# EasyEDA Pro project CameraTargetV1.eprj, board PCB1
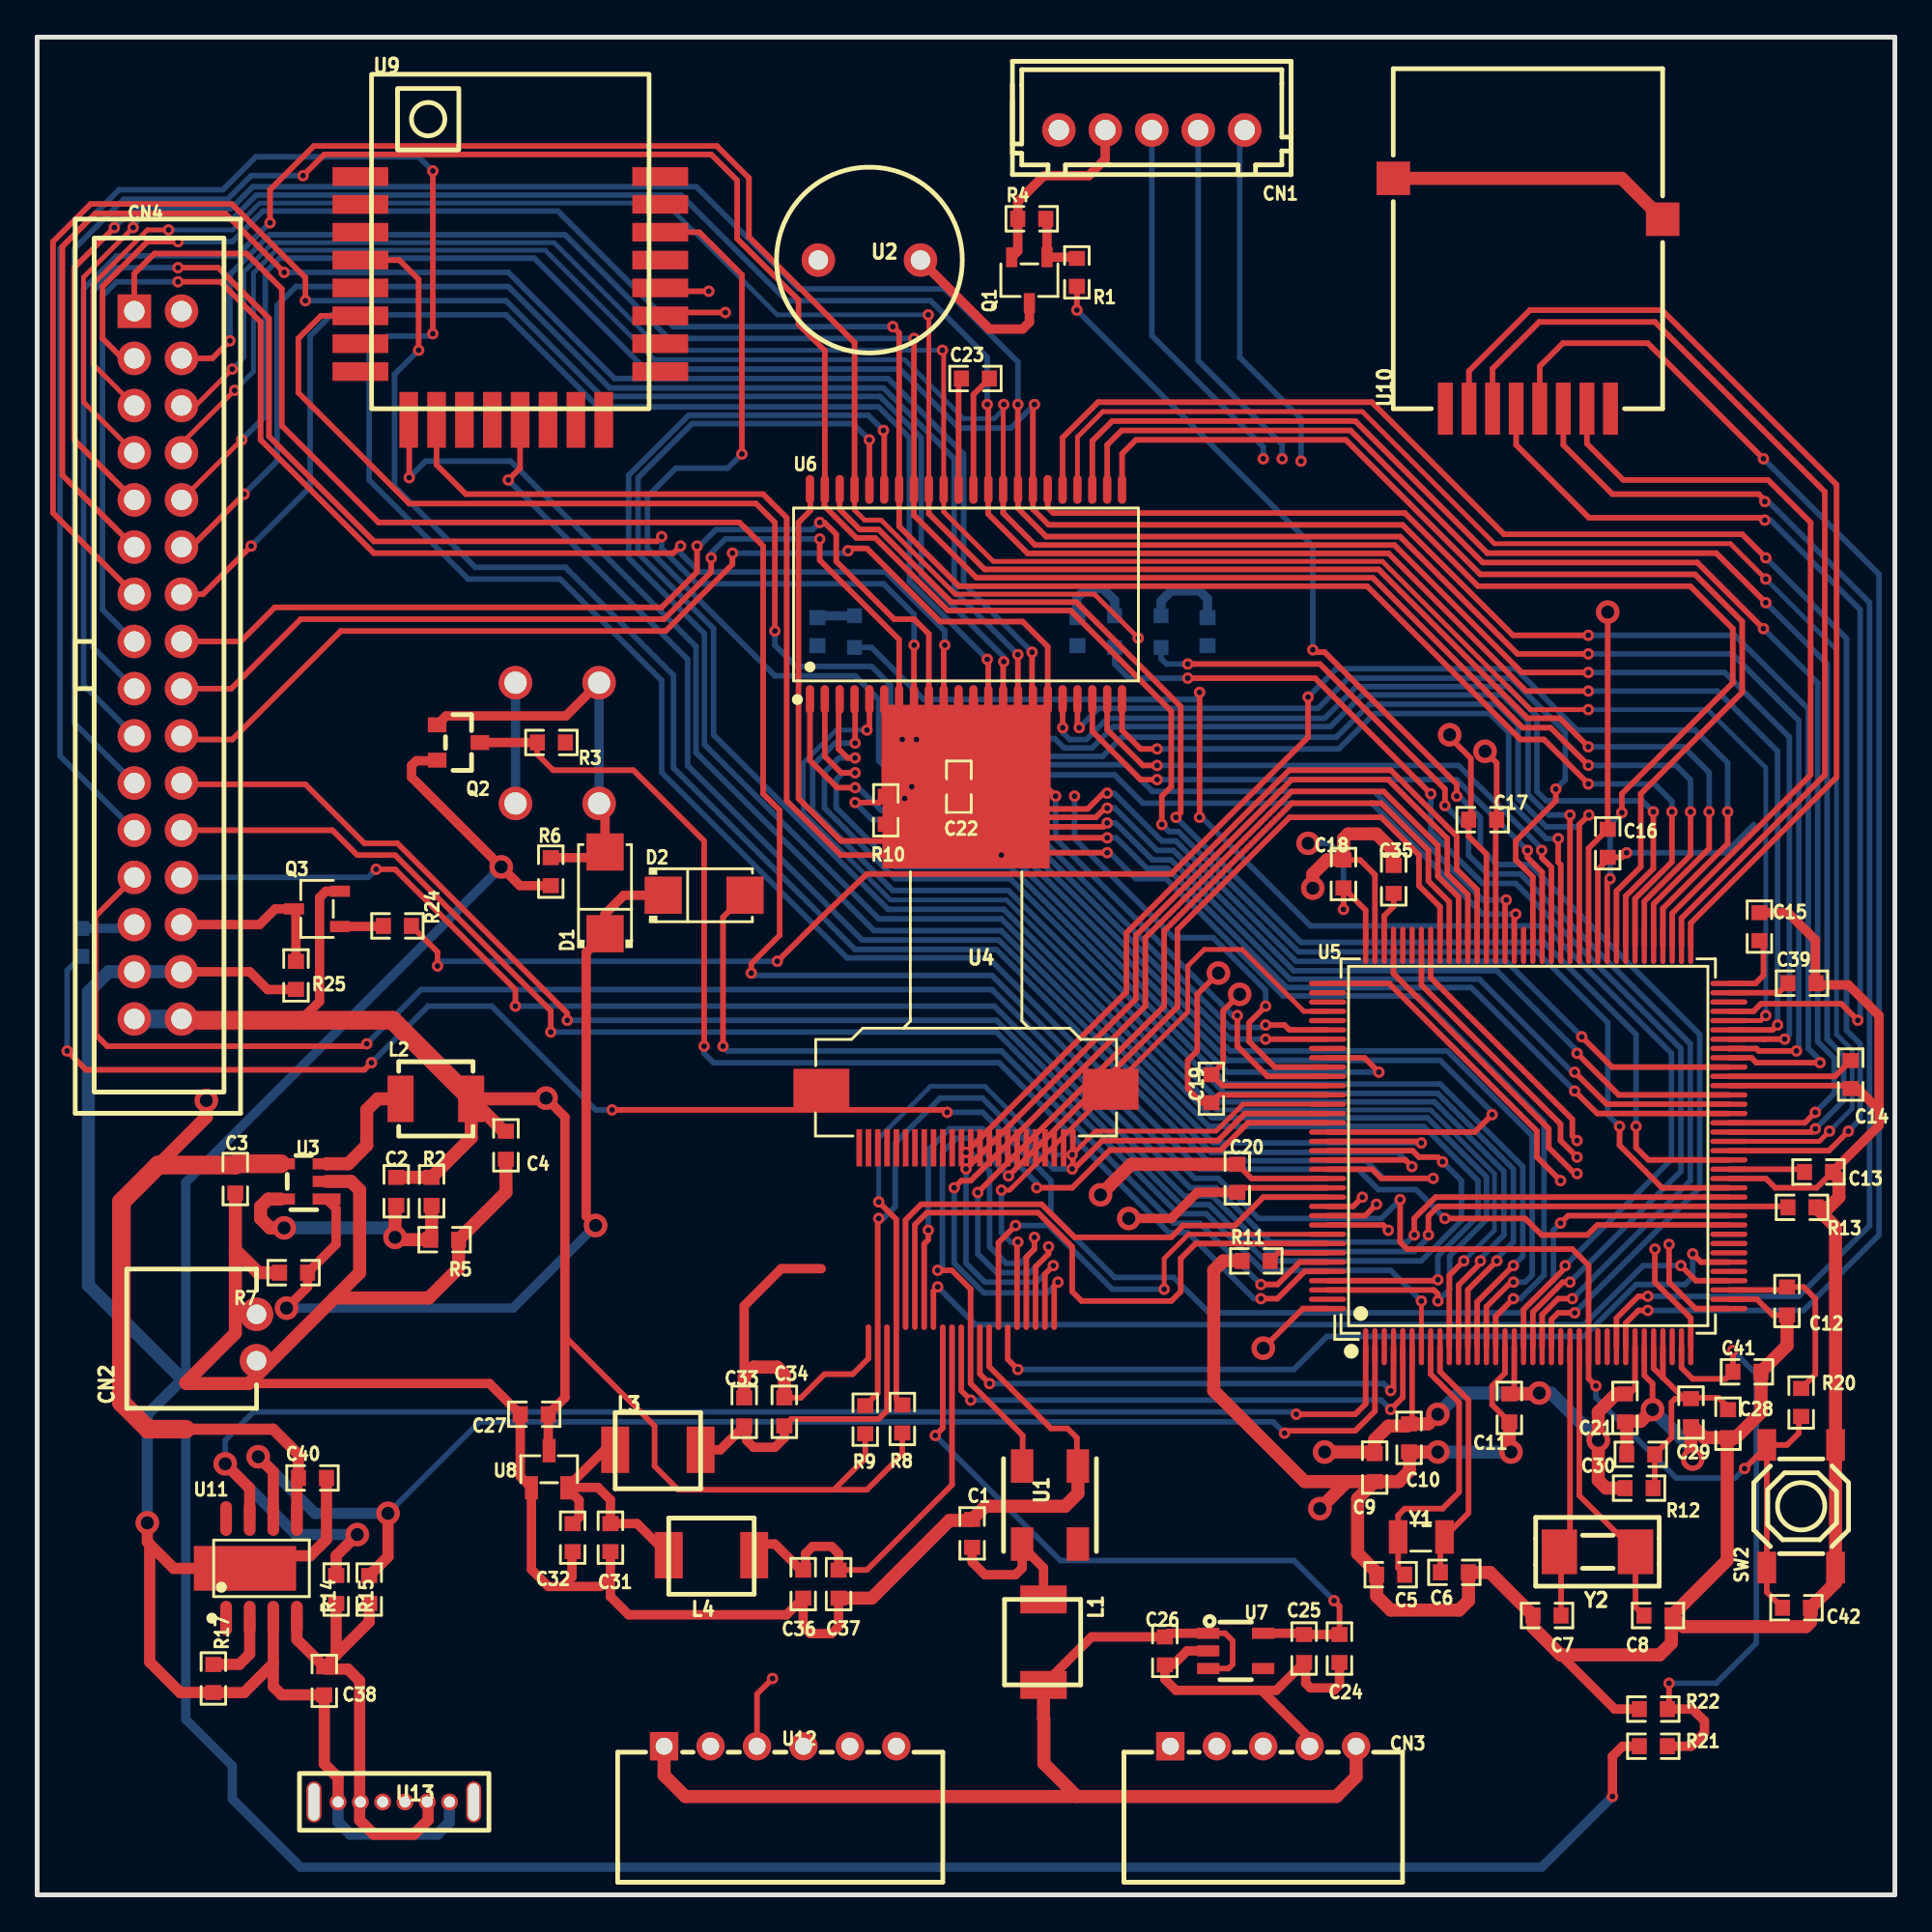
[diagram p1: board, top side]
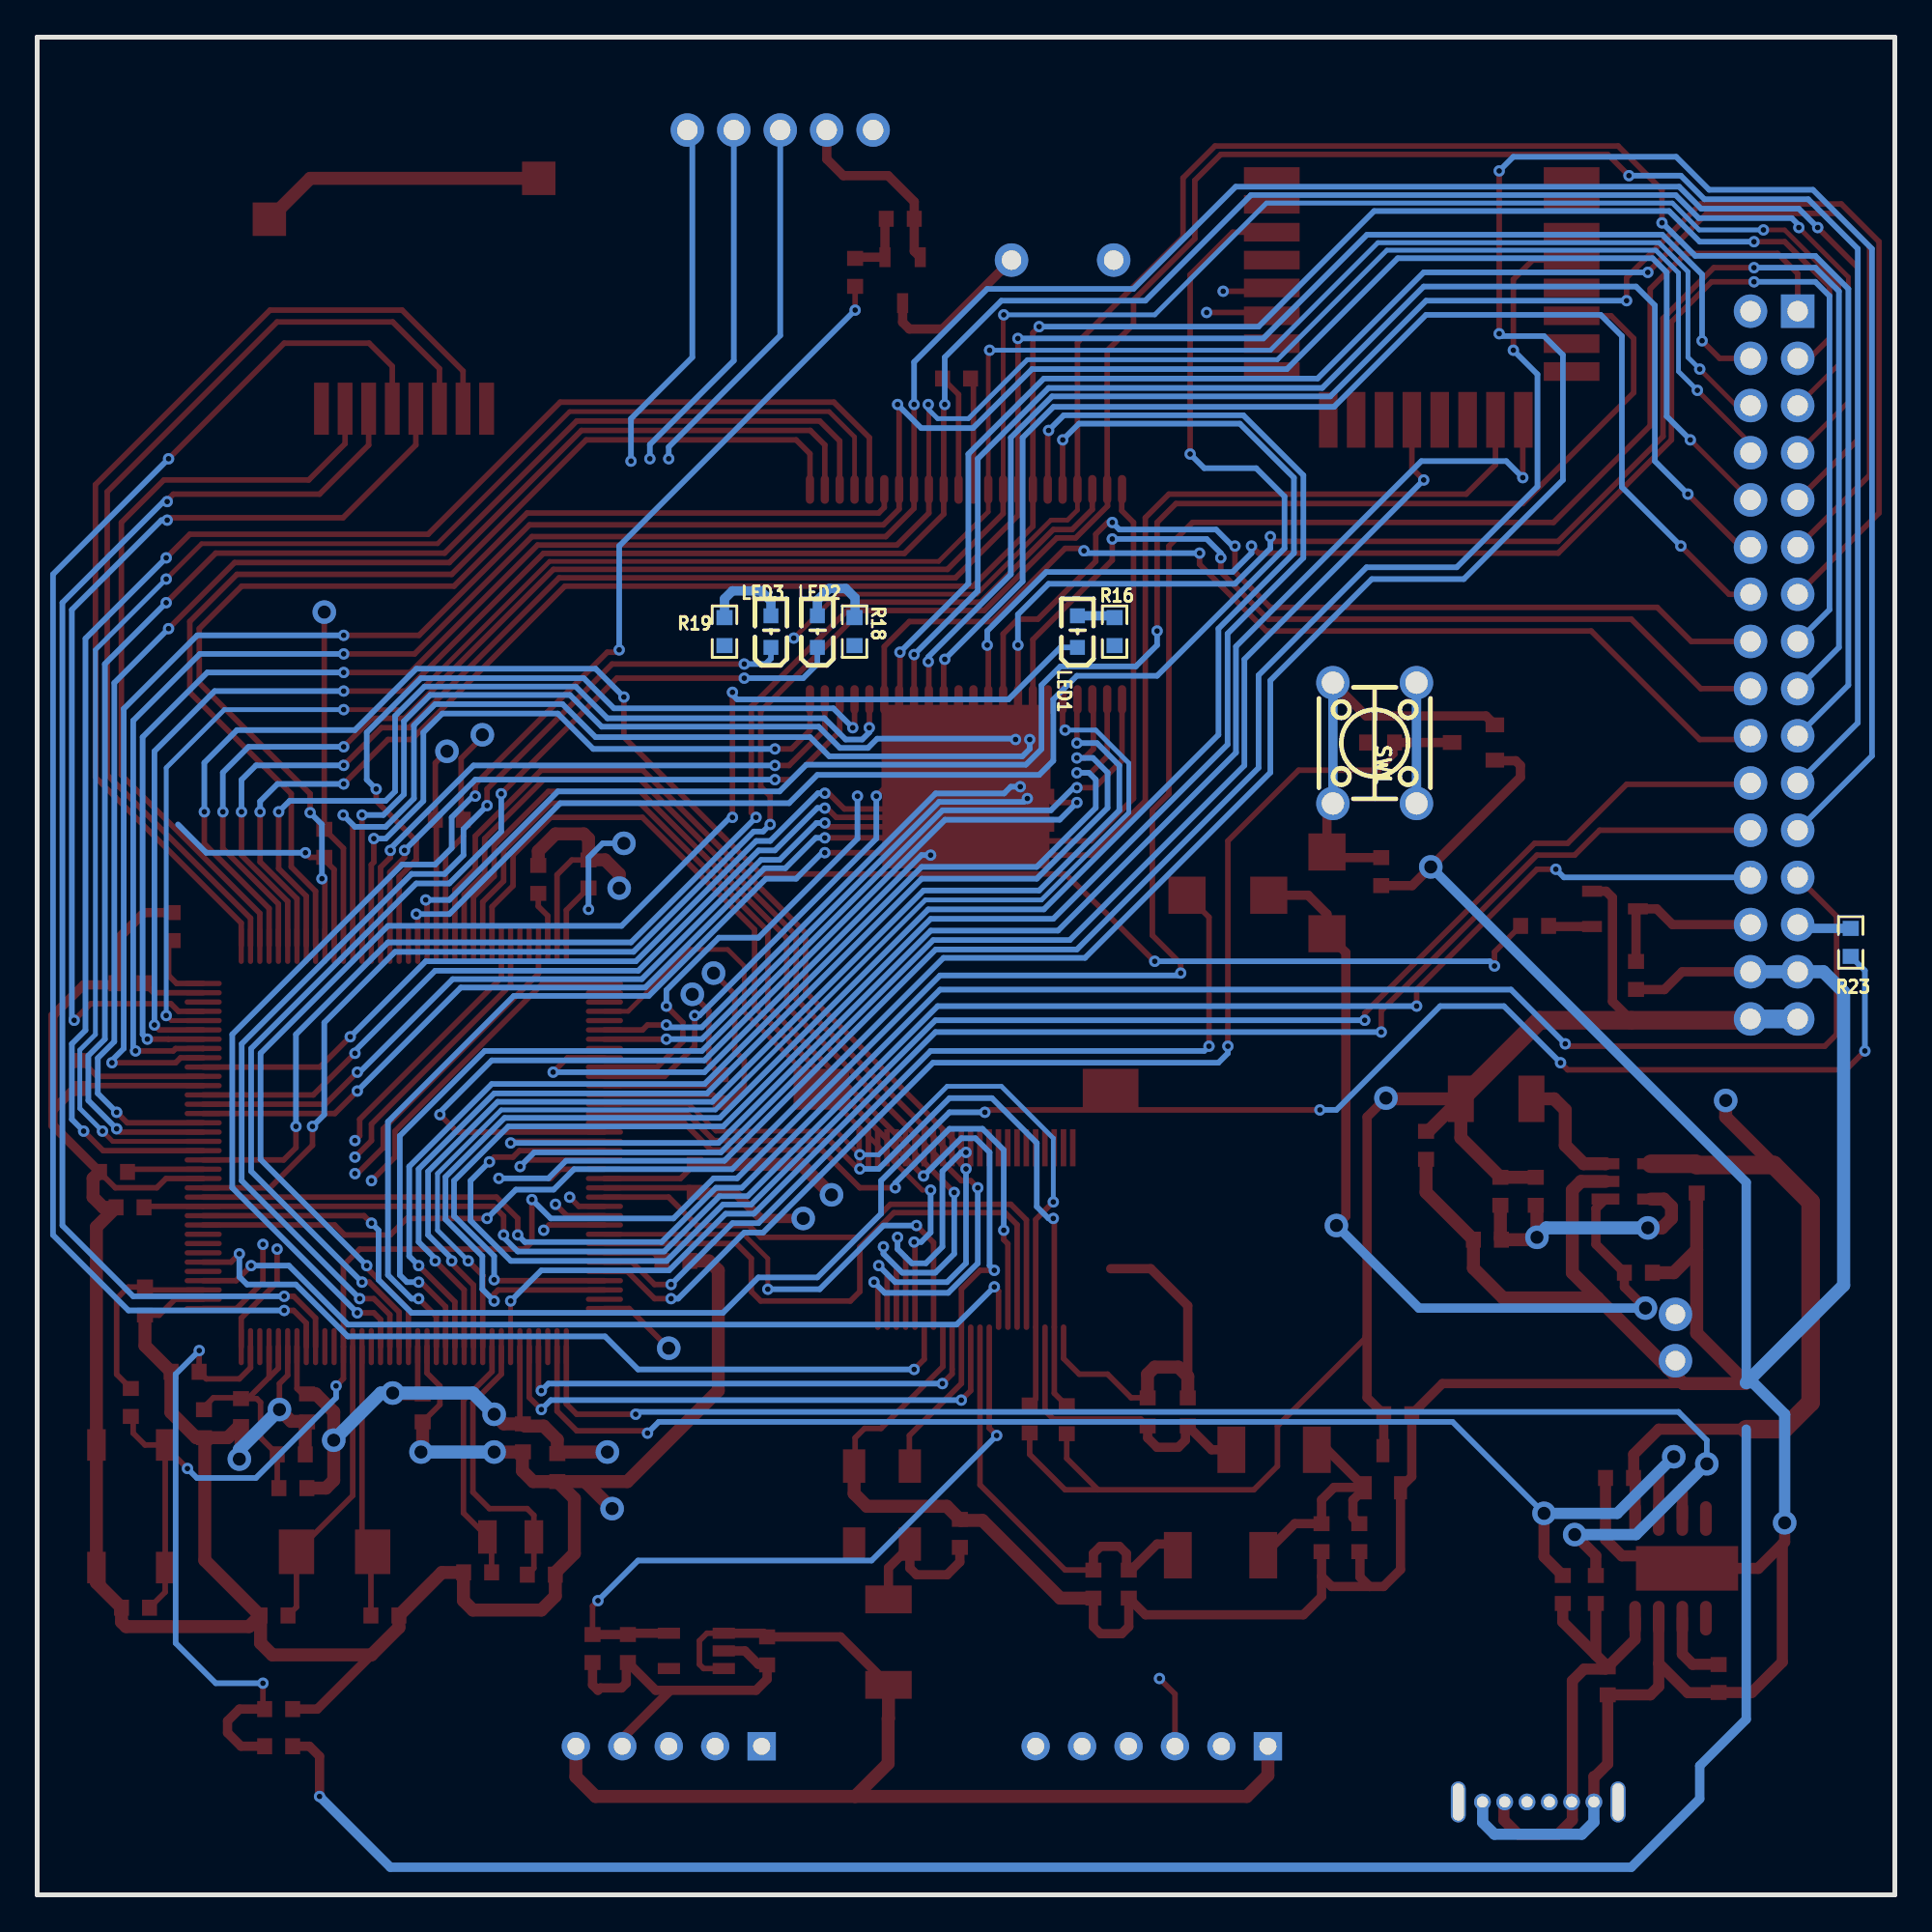
[diagram p2: board, bottom side, seen from below]

Outline 100 x 100 mm; copper layers: Top Layer, CPU1, CPU2, Bottom Layer. Coordinates in mm from the lower left corner of the outline.
Outline path: 0,100 0,0 arc(0,0) 0,0 100,0 arc(100,0) 100,0 100,100 arc(100,100) 100,100 0,100 arc(0,100) 0,100
Stack: Top Layer 0.035mm / Dielectric1 0.48mm PP er 4.5 / CPU1 0.035mm / Dielectric2 0.48mm FR4 er 4.5 / CPU2 0.035mm / Dielectric3 0.48mm PP er 4.5 / Bottom Layer 0.035mm

## Design rules (mm)
spacing safeClearance (default): track to track 0.152, other pairs 0.152 to 0.3
track width trackWidth (default): min 0.127, default 0.254, max 2.54
differential pair differentialPair (default): width min 0.127, default 0.254, max 2.54; gap min 0.152, default 0.152
via viaSize (default): diameter min 0.5, default 0.61, max 10; hole min 0.3, default 0.305, max 6

## Placement (name value [footprint] x y rotation side)
C1  -  [0603]  50.33 19.46 270 top
C2  -  [0603]  19.33 37.87 90 top
C3  -  [0603]  10.67 38.53 90 top
C4  -  [0603]  25.24 40.35 90 top
C5  -  [0603]  72.86 17.23 180 top
C6  -  [0603]  76.29 17.36 0 top
C7  -  [0603]  81.28 15.04 180 top
C8  -  [0603]  87.25 15.04 0 top
C9  -  [0603]  72 23 90 top
C10  -  [0603]  73.85 24.6 90 top
C11  -  [0603]  79.25 26.21 90 top
C12  -  [0603]  94.2 31.97 90 top
C13  -  [0603]  95.89 38.91 180 top
C14  -  [0603]  97.63 44.16 90 top
C15  -  [0603]  92.71 52.12 270 top
C16  -  [0603]  84.54 56.6 90 top
C17  -  [0603]  77.81 57.87 180 top
C18  -  [0603]  70.32 54.95 270 top
C19  -  [0603]  63.21 43.4 270 top
C20  -  [0603]  64.61 38.57 270 top
C21  -  [0603]  85.47 26.21 90 top
C22  -  [0603]  49.62 59.65 90 top
C23  -  [0603]  50.51 81.62 0 top
C24  -  [0603]  70.1 13.26 90 top
C25  -  [0603]  68.2 13.26 90 top
C26  -  [0603]  60.71 13.13 90 top
C27  -  [0603]  26.76 25.87 0 top
C28  -  [0603]  91.02 25.36 90 top
C29  -  [0603]  89.03 25.96 90 top
C30  -  [0603]  86.32 23.71 0 top
C31  -  [0603]  30.86 19.23 90 top
C32  -  [0603]  28.83 19.23 90 top
C33  -  [0603]  38.06 26 270 top
C34  -  [0603]  40.22 26 270 top
C35  -  [0603]  73.03 54.66 90 top
C36  -  [0603]  41.24 16.73 90 top
C37  -  [0603]  43.14 16.73 90 top
C38  -  [0603]  15.46 11.52 90 top
C39  -  [0603]  95 49.07 0 top
C40  -  [0603]  14.82 22.44 180 top
C41  -  [0603]  92.04 28.16 0 top
C42  -  [0603]  94.7 15.46 180 top
CN1  灯板连接口  [CONN-TH_5P-P2.50_HX25003-5A]  60 95 180 top
CN2  -  [XH2.54插件2P]  8 30 270 top
CN3  HDGC2501WR-5P  [CONN-TH_5P-P2.50_HDGC2501WR-5P]  66 8 0 top
CN4  BH-00169  [IDC-TH_BH-00169]  6.5 66.2 270 top
D1  SS14A  [SMA_L4.3-W2.6-LS5.2-RD]  30.57 53.94 90 top
D2  SS14A  [SMA_L4.3-W2.6-LS5.2-RD]  35.9 53.81 0 top
L1  -  [0420]  56.17 15.9 270 top
L2  2.2uH  [IND-SMD_L4.0-W4.0_0.47UH04209.5A]  21.46 42.85 0 top
L3  -  [0420]  31.12 25.96 0 top
L4  -  [0420]  34 20.28 0 top
LED1  RED  [LED0603-R-RD_RED]  44 68 90 bottom
LED2  NCD0603R3  [LED0603-R-RD_RED]  58 68 90 bottom
LED3  NCD0603R3  [LED0603-R-RD_RED]  60.5 68 90 bottom
Q1  S8050  [SOT-23-3_L2.9-W1.6-P1.90-LS2.8-BR]  53.41 86.92 90 top
Q2  AO3400  [SOT-23_L2.9-W1.3-P1.90-LS2.4-BR]  22.68 62.03 180 top
Q3  S9012  [SOT-23-3_L2.9-W1.6-P1.90-LS2.8-BR]  15.07 53.08 0 top
R1  -  [0603]  55.97 87.34 90 top
R2  -  [0603]  21.23 37.87 90 top
R3  -  [0603]  27.68 62.03 180 top
R4  -  [0603]  53.54 90.22 0 top
R5  -  [0603]  21.93 35.27 180 top
R6  -  [0603]  27.65 55.08 270 top
R7  -  [0603]  13.81 33.49 0 top
R8  -  [0603]  46.57 25.62 90 top
R9  -  [0603]  44.58 25.58 90 top
R10  -  [0603]  45.68 58.38 270 top
R11  -  [0603]  65.62 34.13 0 top
R12  -  [0603]  86.23 21.9 180 top
R13  -  [0603]  95 37.01 0 top
R14  -  [0603]  16.1 16.44 270 top
R15  -  [0603]  17.87 16.44 270 top
R16  -  [0603]  42 68 270 bottom
R17  -  [0603]  9.49 11.65 270 top
R18  -  [0603]  56 68 270 bottom
R19  -  [0603]  63 68 270 bottom
R20  -  [0603]  94.96 26.51 270 top
R21  -  [0603]  87 8 0 top
R22  -  [0603]  87 10 180 top
R23  -  [0603]  2.38 51.27 270 bottom
R24  -  [0603]  19.39 52.16 180 top
R25  -  [0603]  13.93 49.49 270 top
SW1  -  [按钮开关]  28 62 90 bottom
SW2  1TS001G-2700-1500-CT  [SW-SMD_4P-L5.1-W5.1-P3.70-LS6.5-TL-2]  94.96 20.92 90 top
U1  -  [5032-4P]  54.52 20.98 90 top
U2  -  [0905蜂鸣器]  44.8 88 0 top
U3  -  [PW2051]  14.35 38.41 0 top
U4  -  [OV2640]  50 50 0 top
U5  STM32F407ZGT6  [LQFP-144_L20.0-W20.0-P0.50-LS22.0-BL]  80.26 40.31 0 top
U6  IS62WV51216BLL-55TLI  [TSOP-44_L18.4-W10.2-P0.80-LS11.8-BL]  50 70 0 top
U7  -  [XC6219B132MR]  64.52 13.13 270 top
U8  XC6206P282MR  [SOT-23-3_L2.9-W1.3-P1.90-LS2.4-BR]  27.56 22.91 270 top
U9  -  [JDY-17]  18 98 0 top
U10  -  [GT-24]  73 80 90 top
U11  -  [PW4056]  12.08 17.58 0 top
U12  HDGC2501WR-6P  [CONN-TH_6P-P2.50_HDGC_HDGC2501WR-6P]  40 8 0 top
U13  -  [typec]  19.2 5 0 top
Y1  -  [3215]  74.51 19.27 180 top
Y2  -  [5032]  83.95 18.47 180 top

## Footprints (pads in the part's own frame, mm; a bottom-side part is the same pattern mirrored in y, then rotated)
0420
  rect 1.5x2.5 smd: 1(0,-2) 2(4.6,-2)
0603
  rect 0.806x0.864 smd: 1(-0.753,0) 2(0.753,0)
0905蜂鸣器
  round 1.8 hole 1.05: 1(-2.75,0) 2(2.75,0)
3215
  rect 1x1.8 smd: 1(-1.25,0) 2(1.25,0)
5032
  rect 1.9x2.401 smd: 1(-2.093,0) 2(2.007,0)
5032-4P
  rect 1.8x1.2 smd: 1(-2.1,-1.5) 2(2.1,-1.5) 3(2.1,1.5) 4(-2.1,1.5)
CONN-TH_5P-P2.50_HDGC2501WR-5P
  rect 1.524x1.524 hole 0.914: 1(-5,0)
  round 1.524 hole 0.914: 2(-2.5,0) 3(0,0) 4(2.5,0) 5(5,0)
CONN-TH_5P-P2.50_HX25003-5A
  round 1.8 hole 1.1: 1(-5,0) 2(-2.5,0) 3(0,0) 4(2.5,0) 5(5,0)
CONN-TH_6P-P2.50_HDGC_HDGC2501WR-6P
  rect 1.524x1.524 hole 0.914: 1(-6.25,0)
  round 1.524 hole 0.914: 2(-3.75,0) 3(-1.25,0) 4(1.25,0) 5(3.75,0) 6(6.25,0)
GT-24
  rect 2.8x0.8 smd: 1(0,-2.805) 2(0,-4.075) 3(0,-5.345) 4(0,-6.615) 5(0,-7.885) 6(0,-9.155) 7(0,-10.425) 8(0,-11.695)
  rect 1.8x1.8 smd: 9(12.4,0) 10(10.2,-14.5)
IDC-TH_BH-00169
  rect 1.8x1.8 hole 1.1: 1(-19.05,-1.27)
  round 1.8 hole 1.1: 2(-19.05,1.27) 3(-16.51,-1.27) 4(-16.51,1.27) 5(-13.97,-1.27) 6(-13.97,1.27) 7(-11.43,-1.27) 8(-11.43,1.27) 9(-8.89,-1.27) 10(-8.89,1.27) 11(-6.35,-1.27) 12(-6.35,1.27) 13(-3.81,-1.27) 14(-3.81,1.27) 15(-1.27,-1.27) 16(-1.27,1.27) 17(1.27,-1.27) 18(1.27,1.27) 19(3.81,-1.27) 20(3.81,1.27) 21(6.35,-1.27) 22(6.35,1.27) 23(8.89,-1.27) 24(8.89,1.27) 25(11.43,-1.27) 26(11.43,1.27) 27(13.97,-1.27) 28(13.97,1.27) 29(16.51,-1.27) 30(16.51,1.27) 31(19.05,-1.27) 32(19.05,1.27)
IND-SMD_L4.0-W4.0_0.47UH04209.5A
  rect 1.399x2.499 smd: 1(-1.9,0) 2(1.9,0)
JDY-17
  rect 3x1 smd: 1(-0.6,-5.5) 2(-0.6,-7) 3(-0.6,-8.5) 4(-0.6,-10) 5(-0.6,-11.5) 6(-0.6,-13) 7(-0.6,-14.5) 8(-0.6,-16) 17(15.54,-16) 18(15.54,-14.5) 19(15.54,-13) 20(15.54,-11.5) 21(15.54,-10) 22(15.54,-8.5) 23(15.54,-7) 24(15.54,-5.5)
  rect 1x3 smd: 9(2,-18.6) 10(3.5,-18.6) 11(5,-18.6) 12(6.5,-18.6) 13(8,-18.6) 14(9.5,-18.6) 15(11,-18.6) 16(12.5,-18.6)
LED0603-R-RD_RED
  rect 0.8x0.8 smd: 1(0.851,0) 2(-0.851,0)
LQFP-144_L20.0-W20.0-P0.50-LS22.0-BL
  oval 0.28x2 smd: 1(-8.75,-10.8) 2(-8.25,-10.8) 3(-7.75,-10.8) 4(-7.25,-10.8) 5(-6.75,-10.8) 6(-6.25,-10.8) 7(-5.75,-10.8) 8(-5.25,-10.8) 9(-4.75,-10.8) 10(-4.25,-10.8) 11(-3.75,-10.8) 12(-3.25,-10.8) 13(-2.75,-10.8) 14(-2.25,-10.8) 15(-1.75,-10.8) 16(-1.25,-10.8) 17(-0.75,-10.8) 18(-0.25,-10.8) 19(0.25,-10.8) 20(0.75,-10.8) 21(1.25,-10.8) 22(1.75,-10.8) 23(2.25,-10.8) 24(2.75,-10.8) 25(3.25,-10.8) 26(3.75,-10.8) 27(4.25,-10.8) 28(4.75,-10.8) 29(5.25,-10.8) 30(5.75,-10.8) 31(6.25,-10.8) 32(6.75,-10.8) 33(7.25,-10.8) 34(7.75,-10.8) 35(8.25,-10.8) 36(8.75,-10.8) 73(8.75,10.8) 74(8.25,10.8) 75(7.75,10.8) 76(7.25,10.8) 77(6.75,10.8) 78(6.25,10.8) 79(5.75,10.8) 80(5.25,10.8) 81(4.75,10.8) 82(4.25,10.8) 83(3.75,10.8) 84(3.25,10.8) 85(2.75,10.8) 86(2.25,10.8) 87(1.75,10.8) 88(1.25,10.8) 89(0.75,10.8) 90(0.25,10.8) 91(-0.25,10.8) 92(-0.75,10.8) 93(-1.25,10.8) 94(-1.75,10.8) 95(-2.25,10.8) 96(-2.75,10.8) 97(-3.25,10.8) 98(-3.75,10.8) 99(-4.25,10.8) 100(-4.75,10.8) 101(-5.25,10.8) 102(-5.75,10.8) 103(-6.25,10.8) 104(-6.75,10.8) 105(-7.25,10.8) 106(-7.75,10.8) 107(-8.25,10.8) 108(-8.75,10.8)
  oval 2x0.28 smd: 37(10.8,-8.75) 38(10.8,-8.25) 39(10.8,-7.75) 40(10.8,-7.25) 41(10.8,-6.75) 42(10.8,-6.25) 43(10.8,-5.75) 44(10.8,-5.25) 45(10.8,-4.75) 46(10.8,-4.25) 47(10.8,-3.75) 48(10.8,-3.25) 49(10.8,-2.75) 50(10.8,-2.25) 51(10.8,-1.75) 52(10.8,-1.25) 53(10.8,-0.75) 54(10.8,-0.25) 55(10.8,0.25) 56(10.8,0.75) 57(10.8,1.25) 58(10.8,1.75) 59(10.8,2.25) 60(10.8,2.75) 61(10.8,3.25) 62(10.8,3.75) 63(10.8,4.25) 64(10.8,4.75) 65(10.8,5.25) 66(10.8,5.75) 67(10.8,6.25) 68(10.8,6.75) 69(10.8,7.25) 70(10.8,7.75) 71(10.8,8.25) 72(10.8,8.75) 109(-10.8,8.75) 110(-10.8,8.25) 111(-10.8,7.75) 112(-10.8,7.25) 113(-10.8,6.75) 114(-10.8,6.25) 115(-10.8,5.75) 116(-10.8,5.25) 117(-10.8,4.75) 118(-10.8,4.25) 119(-10.8,3.75) 120(-10.8,3.25) 121(-10.8,2.75) 122(-10.8,2.25) 123(-10.8,1.75) 124(-10.8,1.25) 125(-10.8,0.75) 126(-10.8,0.25) 127(-10.8,-0.25) 128(-10.8,-0.75) 129(-10.8,-1.25) 130(-10.8,-1.75) 131(-10.8,-2.25) 132(-10.8,-2.75) 133(-10.8,-3.25) 134(-10.8,-3.75) 135(-10.8,-4.25) 136(-10.8,-4.75) 137(-10.8,-5.25) 138(-10.8,-5.75) 139(-10.8,-6.25) 140(-10.8,-6.75) 141(-10.8,-7.25) 142(-10.8,-7.75) 143(-10.8,-8.25) 144(-10.8,-8.75)
OV2640
  rect 0.3x2 smd: 1(-5.747,-9.785) 2(-5.247,-9.785) 3(-4.747,-9.785) 4(-4.247,-9.785) 5(-3.747,-9.785) 6(-3.247,-9.785) 7(-2.747,-9.785) 8(-2.247,-9.785) 9(-1.747,-9.785) 10(-1.247,-9.785) 11(-0.747,-9.785) 12(-0.247,-9.785) 13(0.253,-9.785) 14(0.753,-9.785) 15(1.253,-9.785) 16(1.753,-9.785) 17(2.253,-9.785) 18(2.753,-9.785) 19(3.253,-9.785) 20(3.753,-9.785) 21(4.253,-9.785) 22(4.753,-9.785) 23(5.253,-9.785) 24(5.753,-9.785)
  rect 3x2.2 smd: 25(7.785,-6.636) 26(-7.785,-6.636)
  rect 9x8.8 smd: 27(0.006,9.658)
PW2051
  rect 1.5x0.6 smd: 1(1.227,-0.95) 2(1.227,0) 3(1.227,0.95) 4(-1.227,0.95) 5(-1.227,-0.95)
PW4056
  oval 0.63x1.865 smd: 1(-1.905,-2.683) 2(-0.635,-2.683) 3(0.635,-2.683) 4(1.905,-2.683) 5(1.905,2.683) 6(0.635,2.683) 7(-0.635,2.683) 8(-1.905,2.683)
  rect 5.5x2.4 smd: 9(-0.889,0)
SMA_L4.3-W2.6-LS5.2-RD
  rect 2x2 smd: 1(-2.2,0) 2(2.2,0)
SOT-23-3_L2.9-W1.3-P1.90-LS2.4-BR
  rect 1.25x0.7 smd: 1(1,-0.95) 2(1,0.95) 3(-1,0)
SOT-23-3_L2.9-W1.6-P1.90-LS2.8-BR
  rect 1.07x0.6 smd: 1(1.235,-0.95) 2(1.235,0.95) 3(-1.235,0)
SOT-23_L2.9-W1.3-P1.90-LS2.4-BR
  rect 1x0.8 smd: 1(1.15,-0.95) 2(1.15,0.95) 3(-1.15,0)
SW-SMD_4P-L5.1-W5.1-P3.70-LS6.5-TL-2
  rect 1.7x1 smd: 1(-3.3,1.849) 2(3.3,1.851) 3(-3.3,-1.851) 4(3.3,-1.851)
TSOP-44_L18.4-W10.2-P0.80-LS11.8-BL
  oval 0.448x1.551 smd: 1(-8.4,-5.655) 2(-7.6,-5.655) 3(-6.8,-5.655) 4(-6,-5.655) 5(-5.2,-5.655) 6(-4.4,-5.655) 7(-3.6,-5.655) 8(-2.8,-5.655) 9(-2,-5.655) 10(-1.2,-5.655) 11(-0.4,-5.655) 12(0.4,-5.655) 13(1.2,-5.655) 14(2,-5.655) 15(2.8,-5.655) 16(3.6,-5.655) 17(4.4,-5.655) 18(5.2,-5.655) 19(6,-5.655) 20(6.8,-5.655) 21(7.6,-5.655) 22(8.4,-5.655) 23(8.4,5.655) 24(7.6,5.655) 25(6.8,5.655) 26(6,5.655) 27(5.2,5.655) 28(4.4,5.655) 29(3.6,5.655) 30(2.8,5.655) 31(2,5.655) 32(1.2,5.655) 33(0.4,5.655) 34(-0.4,5.655) 35(-1.2,5.655) 36(-2,5.655) 37(-2.8,5.655) 38(-3.6,5.655) 39(-4.4,5.655) 40(-5.2,5.655) 41(-6,5.655) 42(-6.8,5.655) 43(-7.6,5.655) 44(-8.4,5.655)
typec
  round 0.9 hole 0.6: 1(-3,0) 2(-1.8,0) 3(-0.6,0) 4(0.6,0) 5(1.8,0) 6(3,0)
  oval 0.8x2.2 hole 0.6x2: 7(-4.3,0) 8(4.3,0)
XC6219B132MR
  rect 0.6x1.2 smd: 1(-0.95,-1.477) 2(0,-1.477) 3(0.95,-1.477) 4(0.95,1.477) 5(-0.95,1.477)
XH2.54插件2P
  round 1.8 hole 1.05: 1(1.25,3.81) 2(-1.25,3.81)
按钮开关
  round 1.8 hole 1.2: 1(-3.25,2.25) 2(3.25,2.25) 3(-3.25,-2.25) 4(3.25,-2.25)

## Nets
As in the schematic.

Pads without a net: U1 1; U4 1 23 24 27; U5 3 22 26 27 34 41 43 44 45 70 91 103 104 110 111 113 116; U7 4; U9 2 3 5 7 8 11 12 14 15 16 17 18 21 23; U11 1 8; U13 3 4 7 8

## Via types
v1: diameter 0.61, hole 0.305, Top Layer to Bottom Layer, 229 vias
v2: diameter 1.27, hole 0.711, Top Layer to Bottom Layer, 30 vias
v3: diameter 1.27, hole 0.712, Top Layer to Bottom Layer, 1 via

## Routing (per net, layer and track width the routed paths; a pad name or vN(x,y) marks a point on that pad's centre or on a via; arc(x,y) is an arc through that point)
+3.3V: length 452.4
  Top Layer w0.3: C23.2 50.4,80.76 U6.33 ; R8.1 46.57,23.71 44.67,21.81 42.89,21.81 ; C16.2 v2(84.54,69.05) ; C16.2 84.67,57.36 ; C16.2 84.54,57.36 83.51,56.34 U5.84 ; 85.35,26.97 85.73,26.97 86.01,27.26 U5.30 ; 28.41,30.06 33.24,25.24 33.24,23.08 34.51,21.81 42.89,21.81 ; C22.2 49.61,60.41 46.83,57.63 R10.2 ; C12.2 95.09,32.72 95.72,32.09 95.72,28.02 R20.1 ; R9.1 44.58,23.5 42.89,21.81 ; U7.1 63.95,14.08 64.35,13.68 64.35,12.41 64.13,12.18 U7.3 ; U5.144 68.14,31.56 v2(66,29.43) ; v1(70.32,53.05) C18.2 71.51,53.01 U5.108 ; U5.52 94.99,39.06 C13.2 ; C10.2 74.01,25.52 U5.6 ; C11.2 79.51,27.23 U5.17 ; v2(63.59,49.62) 62.45,48.48 62.45,45.43 61.94,44.92 61.94,43.4 62.69,42.64 C19.2 63.63,43.06 U5.121 ; 93.99,32.56 93.99,32.56 ; U5.131 64.85,38.06 C20.2 ; U5.39 93.86,32.56 ; U5.72 92.49,49.06 92.93,49.49 92.93,51.15 C15.2 ; v2(76.04,62.45) 76.04,62.32 77.18,61.18 77.18,57.99 C17.2 77.06,56.98 78.01,56.02 U5.95 ; U5.62 96.77,44.06 C14.2
  Top Layer w0.5: L1.2 56.76,13.89 C26.2 60.9,14.08 U7.1 ; C20.2 62.45,37.82 61.05,36.41 v2(58.76,36.41) ; C22.2 49.6,60.42 U6.11 ; Q3.2 15.54,54.03 15.2,53.68 15.2,48.1 14.19,47.08 ; v2(27.39,42.89) 28.41,41.87 28.41,26.77 C27.2 27.51,23.96 U8.3
  Top Layer w0.7: 55.97,5.3 69.94,5.3 71,6.36 CN3.5 ; 55.97,5.3 54.19,7.07 54.19,9.49 54.17,9.51 L1.2 ; 55.97,5.3 34.89,5.3 33.75,6.43 U12.1 ; C4.2 25.11,41.1 L2.2 ; R12.2 84.46,21.9 84.04,22.31 v2(84.04,24.47) 84.04,26 85.01,26.97 85.35,26.97 ; v2(75.4,25.87) 74.88,25.35 C10.2 73.73,25.24 72.73,25.24 72,24.5 C9.2 71.92,23.84 v2(69.3,23.84) ; L2.2 27.36,42.85 v2(27.39,42.89) ; L2.2 23.36,40.75 R2.2 C2.2 ; C11.2 80.81,26.97 v2(80.86,27.01)
  Top Layer w1: L2.2 19.13,47.08 7.84,47.08 CN4.32
  CPU1 w0.7: v2(63.59,49.62) 62.32,49.62 60.29,47.59 60.29,38.82 58.76,37.3 v2(58.76,36.41) 65.75,29.43 v2(66,29.43) 67.15,29.43 69.3,27.27 v2(69.3,23.84) 46.44,23.84 v2(27.39,42.89) 27.39,14.36 U12.1 ; v2(76.04,62.45) 76.04,64.48 80.61,69.05 v2(84.54,69.05)
  CPU2 w0.7: v2(63.59,49.62) 66.76,52.79 66.76,54.95 v2(68.42,56.6) 74.26,62.45 v2(76.04,62.45)
  Bottom Layer w0.3: v1(70.32,53.05) 70.32,55.84 69.56,56.6 v2(68.42,56.6)
  Bottom Layer w0.7: v2(75.4,25.87) 76.54,27.01 81.5,27.01 v2(84.04,24.47)
  Bottom Layer w1: CN4.31 CN4.32
+3.7V: length 170.9
  Top Layer w0.5: v1(84.8,5.3) 84.8,7.46 85.34,8 R21.1
  Top Layer w0.6: 8,25.07 12.7,25.07 14.06,23.71 14.06,22.45 ; 14.06,22.45 C40.2 ; 14.06,22.45 13.98,22.37 U11.5
  Top Layer w0.7: v2(9.11,42.76) 9.11,41.87 6.52,39.29
  Top Layer w1: 8,25.07 5.97,25.07 4.53,26.51 4.53,37.3 6.52,39.29 C3.2 10.74,39.36 U3.4
  CPU1 w0.7: SW1.3 25.1,58.75 v2(9.11,42.76)
  Bottom Layer w0.5: 8,25.07 8,9.45 10.5,6.95 10.5,5.17 14.19,1.49 80.99,1.49 v1(84.8,5.3) ; SW1.4 SW1.3
AVDD: length 17.1
  Top Layer w0.3: 45.75,30.56 45.75,26.06 45.3,25.62 40.59,25.62 C34.2
  Top Layer w0.5: L3.2 36.78,23.96 C33.2 38.19,25.12 38.19,24.47 38.57,24.09 39.71,24.09 40.22,24.6 C34.2
GND: length 751
  Top Layer w0.3: v1(85.56,56.1) 85.31,55.85 84.67,55.85 ; 84.67,55.85 84.01,55.19 U5.83 ; 84.67,55.85 C16.1 ; C14.1 97.47,43.56 U5.61 ; C11.1 78.32,26.39 78.32,27.39 79.01,28.09 U5.16 ; U6.34 49.6,81.47 C23.1 ; 44.75,30.56 44.75,28.87 43.9,28.03 42.38,28.03 41.11,26.76 40.23,26.76 ; U5.38 92.58,32.06 93.43,31.2 94.19,31.2 C12.1 ; U5.120 63.8,43.56 C19.1 63.84,44.78 63.84,47.59 v2(64.73,48.48) ; v2(86.96,26.12) 86.96,27.52 86.51,27.96 U5.31 ; U5.130 65.37,38.56 C20.1 ; U5.107 72.01,54.91 71.22,55.71 C18.1 ; v2(77.94,61.56) 78.57,60.93 C17.1 78.51,57.82 U5.94 ; C13.1 95.79,38.06 93.56,38.06 93.06,38.56 U5.51 ; 56.02,22.96 55.97,23.01 55.97,24.6 55.46,25.11 54.57,25.11 51.25,28.43 51.25,30.56
  Top Layer w0.5: C13.1 99.15,41.42 99.15,42.25 ; 65.91,11.01 61.3,11.01 60.71,11.61 C26.1 60.74,12.41 61.18,12.41 61.9,13.13 U7.2 ; 65.91,11.01 68.5,8.42 CN3.4 ; 65.91,11.01 66.7,11.01 C25.1 68.29,12.42 68.29,11.39 68.54,11.14 69.69,11.14 69.81,11.01 70.1,11.3 C24.1 ; C37.1 43.14,14.44 42.76,14.06 41.62,14.06 41.24,14.44 C36.1 40.34,15.08 31.84,15.08 30.86,16.05 30.86,17.15 ; C22.1 49.63,58.89 50.51,58.89 50.76,59.14 50.76,61.3 50.4,61.67 U6.12 ; R6.2 25.99,54.33 v3(24.98,55.33) 20.16,60.16 20.16,60.8 20.41,61.05 21.5,61.05 Q2.2 ; C32.1 28.79,18.44 28.79,17.11 28.28,16.6 ; 30.86,17.15 30.32,16.6 28.28,16.6 ; 30.86,17.15 C31.1 ; CN4.30 11.45,49.69 12.41,48.73 13.92,48.73 R25.2 ; 82,12.92 84.92,10 R22.2 ; 11.39,27.52 24.35,27.52 C27.1 26.01,22.51 U8.1 26.61,17.51 27.52,16.6 28.28,16.6 ; C14.1 97.99,43.4 99.15,42.25 ; 42.21,33.71 40.06,33.71 38.06,31.71 38.06,27.9 ; 99.15,42.25 99.15,47.33 97.5,48.98 95.72,48.98 95.72,51.4 94.24,52.87 C15.1 ; Q1.2 52.79,88.48 R4.1 52.79,91.14 54.19,92.55 56.6,92.55 57.49,93.43 57.49,94.99 CN1.4
  Top Layer w0.6: v2(5.93,20.03) 5.93,19 6.06,18.87 ; 12.71,12.46 U11.3 ; 12.71,12.46 12.71,11.22 13.16,10.77 C38.1 15.46,7.05 16.14,6.37 16.2,6.37 U13.1 ; 12.71,12.46 11.14,10.88 9.5,10.88 R17.2 7.7,10.89 6.06,12.54 6.06,18.87 ; C40.1 15.57,19.13 14.69,18.25 11.86,18.25 U11.9 7.35,17.58 6.06,18.87
  Top Layer w0.7: v2(69.05,20.79) 70.38,22.12 70.38,22.25 ; 77.05,17.35 77.05,15.84 76.54,15.33 72.86,15.33 72.11,16.08 72.11,17.35 71.08,18.38 71.08,21.33 C9.1 ; 77.05,17.35 78.21,17.35 C7.2 80.53,14.39 82,12.92 87.34,12.92 87.97,13.55 87.97,15.01 C8.2 ; 77.05,17.35 C6.2 ; C8.2 88.6,14.44 95.21,14.44 95.46,14.69 C42.1 96.81,16.81 SW2.4 96.81,35.95 R13.2 96.44,37.01 96.99,37.55 96.99,38.57 C13.1 ; C8.2 90.98,18.01 90.98,24.56 C28.1 ; R7.1 11.9,33.49 10.67,34.72 ; 73.88,23.82 73.89,23.84 v2(75.4,23.84) ; 73.88,23.82 C10.1 ; 73.88,23.82 73.88,22.82 73.3,22.25 C9.1 ; C3.1 10.67,34.72 ; 10.67,34.72 10.67,30.24 8,27.57 8.05,27.52 11.39,27.52 16,32.13 ; C4.1 25.24,37.82 R5.1 22.69,33.74 21.08,32.13 16,32.13 ; v2(68.67,54.19) 68.67,54.95 69.43,55.72 70.31,55.72 C18.1 70.32,56.86 70.57,57.11 72.1,57.11 73.03,56.19 C35.2 ; 40.23,26.76 40.23,28.02 39.84,28.41 38.57,28.41 38.06,27.9 C33.1 ; C37.1 44.93,15.97 49.11,20.16 50.27,20.16 C1.1 51.04,20.92 55.33,20.92 56.02,21.61 56.02,22.96 ; 85.75,25.49 86.32,25.49 v2(86.96,26.12) ; C28.1 91.44,24.61 92.8,25.97 92.8,28.15 C41.2 94.2,29.56 C12.1 ; C28.1 89.74,24.61 89.15,25.21 C29.1 89.03,23.55 v2(89.12,23.46) ; 16,32.13 17.36,33.49 17.36,37.94 16.89,38.41 U3.2 ; v2(79.34,23.84) 79.25,23.93 C11.1 ; v2(57.24,37.68) 58.88,39.32 C20.1 ; 70.38,22.25 C9.1 ; 70.38,22.25 68.23,22.25 63.34,27.14 63.34,33.62 63.84,34.13 R11.1 ; U10.10 85.3,92.4 U10.9 ; 85.57,25.3 C30.1
  CPU2 w0.7: U12.4 38.55,5.3 ; 38.55,5.3 29.93,5.3 22.95,12.28 22.95,24.47 19.86,27.57 ; 38.55,5.3 67.02,5.3 68.5,6.78 CN3.4 ; v2(57.24,37.68) 57.24,41.36 64.35,48.48 v2(64.73,48.48) 68.67,52.41 v2(68.67,54.19) 68.67,54.7 74.51,60.54 76.8,60.54 77.81,61.56 v2(77.94,61.56) ; 19.86,27.57 8,27.57 ; 19.86,27.57 41.57,27.57 48.35,20.79 v2(69.05,20.79)
  Bottom Layer w0.3: 92.42,57.62 90.89,56.1 v1(85.56,56.1)
  Bottom Layer w0.5: v3(24.98,55.33) 8,38.35 8,27.57
  Bottom Layer w0.6: U13.1 16.2,3.92 16.85,3.26 21.55,3.26 22.19,3.9 22.19,4.96 ; 8,27.57 7.63,27.57 5.93,25.87 v2(5.93,20.03)
  Bottom Layer w0.7: v2(79.34,23.84) v2(75.4,23.84) ; CN4.30 CN4.29 3.84,49.69 2.76,48.6 2.76,32.81 8,27.57 ; v2(89.12,23.46) 89.12,23.97 v2(86.96,26.12)
VCC1.3: length 37.2
  Top Layer w0.3: 48.75,30.56 48.75,25.13 v1(48.35,24.73) ; v1(69.81,15.84) 70.1,15.55 C24.2
  Top Layer w0.5: U7.5 68.13,14.08 C25.2 C24.2
  Bottom Layer w0.3: v1(48.35,24.73) 55.08,18 67.65,18 v1(69.81,15.84)
ADC_BAT: length 33.9
  Top Layer w0.3: v1(91.28,29.3) 91.28,29.29 C41.1 ; 91.28,28.16 90.89,27.78 89.12,27.78 88.51,28.38 U5.35 ; R22.1 87.85,10.09 v1(87.85,11.39)
  Top Layer w0.5: R22.1 89.11,10 89.75,9.36 89.75,8.73 89.03,8 R21.2
  Bottom Layer w0.3: v1(91.28,29.3) 92.55,28.03 92.55,13.55 90.39,11.39 v1(87.85,11.39)
BAT_CHRG: length 81.5
  Top Layer w0.3: U5.1 71.51,26.43 70.96,25.87 v1(67.78,25.87)
  Top Layer w0.6: R14.1 16.1,18.26 v2(17.23,19.39) ; v2(10.12,23.2) 11.44,21.88 U11.7
  Bottom Layer w0.3: v1(67.78,25.87) 67.65,26 11.65,26 10.12,24.47 v2(10.12,23.2)
  Bottom Layer w0.6: v2(10.12,23.2) 13.93,19.39 v2(17.23,19.39)
BAT_DONE: length 75.1
  Top Layer w0.3: v1(67.15,24.85) 67.27,24.98 70.96,24.98 72.01,26.04 U5.2
  Top Layer w0.6: U11.6 12.71,22.77 v2(11.9,23.58) ; R15.1 18.89,18.2 v2(18.89,20.54)
  Bottom Layer w0.3: v1(67.15,24.85) 66.54,25.46 23.81,25.46 v2(18.89,20.54)
  Bottom Layer w0.6: v2(18.89,20.54) 14.95,20.54 v2(11.9,23.58)
BEEP: length 76.2
  Top Layer w0.3: v1(55.97,85.31) R1.1 ; v1(68.67,67.02) 68.8,66.89 69.31,66.89 76.42,59.78 v1(76.42,59.14) ; v1(82.77,31.33) 81.88,31.33 81.51,30.97 U5.21
  Bottom Layer w0.3: v1(68.67,67.02) 68.67,72.61 v1(55.97,85.31) ; v1(76.42,59.14) 76.54,59.14 77.69,58 77.69,56.35 78.58,55.46 80.35,55.46 89.5,46.32 89.5,38.06 v1(82.77,31.33)
DCMI_D0: length 59.1
  Top Layer w0.3: v1(53.68,35.4) 53.68,34.76 53.25,34.32 53.25,30.56 ; U5.96 77.51,54.11 76.42,55.21 76.42,56.99 72.87,60.54 67.4,60.54 58.64,51.78 58.64,48.6 v1(50,39.97)
  Bottom Layer w0.3: v1(53.68,35.4) 53.68,34.76 52.92,34 52.16,34 51.27,34.89 51.27,38.95 50.25,39.97 v1(50,39.97)
DCMI_D1: length 58.2
  Top Layer w0.3: v1(50,39.08) 59.14,48.22 59.14,51.65 67.53,60.03 72.73,60.03 75.91,56.86 75.91,54.96 77.01,53.85 U5.97 ; v1(54.7,33.87) 54.25,33.42 54.25,30.56
  Bottom Layer w0.3: v1(54.7,33.87) 53.81,32.98 51.02,32.98 50,34 v1(50,39.08)
DCMI_D2: length 57.1
  Top Layer w0.3: v1(54.95,32.98) 54.75,32.78 54.75,30.56 ; U5.98 76.51,53.71 75.4,54.83 75.4,56.48 72.48,59.4 67.54,59.4 59.65,51.51 59.65,47.84 50.25,38.44 49.75,38.44 v1(49.37,38.06)
  Bottom Layer w0.3: v1(49.37,38.06) 49.37,34 50.96,32.41 54.38,32.41 v1(54.95,32.98)
DCMI_D3: length 54.9
  Top Layer w0.3: 53.75,30.56 53.75,33.81 54.45,34.51 v1(54.45,34.89) ; v1(50.64,37.81) 60.67,47.84 60.67,51.89 67.54,58.76 72.35,58.76 74.89,56.22 74.89,54.57 76.01,53.45 U5.99
  Bottom Layer w0.3: v1(54.45,34.89) 54.45,34.51 53.43,33.49 51.65,33.49 50.64,34.51 v1(50.64,37.81)
DCMI_D4: length 33.7
  Top Layer w0.254: v1(51.91,37.94) 52.35,37.94 61.94,47.52 61.94,50 62.83,50.89 64.86,50.89 68.19,47.56 U5.112
  Top Layer w0.3: v1(52.79,35.14) 52.75,35.09 52.75,30.56
  Bottom Layer w0.3: v1(51.91,37.94) 51.91,35.65 52.41,35.14 v1(52.79,35.14)
DCMI_D5: length 26.3
  Top Layer w0.254: v1(60.67,32.6) 60.67,34.25 61.98,35.56 U5.136
  Top Layer w0.3: v1(52.67,36.03) 51.75,35.11 51.75,30.56
  Bottom Layer w0.3: v1(52.67,36.03) 54.45,36.03 57.87,32.6 v1(60.67,32.6)
DCMI_D6: length 27.4
  Top Layer w0.3: v1(51.27,27.52) 50.75,28.04 50.75,30.56 ; U5.4 73.01,27.29 v1(72.86,27.14)
  Bottom Layer w0.3: v1(72.86,27.14) 72.48,27.52 v1(51.27,27.52)
DCMI_D7: length 30.6
  Top Layer w0.3: v1(72.86,26.12) 73.51,26.78 U5.5 ; v1(50.25,26.63) 49.75,27.14 49.75,30.56
  Bottom Layer w0.3: v1(72.86,26.12) 72.35,26.63 v1(50.25,26.63)
DCMI_HSYNC: length 47.3
  Top Layer w0.3: v1(48.48,32.73) 48.25,32.5 48.25,30.56 ; v1(88.48,33.87) 89.29,33.06 U5.40
  Bottom Layer w0.3: v1(48.48,32.73) 50.51,30.7 83.27,30.7 86.45,33.87 v1(88.48,33.87)
DCMI_PXCLK: length 44.3
  Top Layer w0.3: 52.25,30.56 52.25,28.83 v1(52.79,28.28) ; v1(89.12,34.51) 89.56,34.06 U5.42
  Bottom Layer w0.3: v1(52.79,28.28) 67.65,28.28 69.43,30.06 83.28,30.06 86.07,32.86 88.7,32.86 89.12,33.27 v1(89.12,34.51)
DCMI_VSYNC: length 33.7
  Top Layer w0.3: U5.137 62.37,35.06 61.56,34.25 61.56,32.47 61.05,31.97 56.22,31.97 55.72,32.47 55.72,34.89 53.88,36.72 47.9,36.72 47.25,36.07 47.25,30.56
DOVDD: length 23.8
  Top Layer w0.3: C37.2 43.15,17.49 44.67,17.49 49.25,22.07 49.25,30.56
  Top Layer w0.5: C37.2 43.14,18.38 42.76,18.76 41.75,18.76 41.36,18.38 41.36,17.61 C36.2 ; 41.12,17.48 39.71,18.89 39.2,18.89 L4.2
FSMC_A0: length 64.1
  Top Layer w0.3: v1(76.8,34.13) 76.01,33.34 U5.10 ; v1(44.67,62.7) 44.8,62.83 U6.5
  Bottom Layer w0.254: v1(76.8,34.13) 78.45,35.78 78.45,38.82 75.02,42.25 63.49,42.25 52.19,53.56 45.94,53.56 41.24,58.26 41.24,60.92 43.02,62.7 v1(44.67,62.7)
FSMC_A1: length 63.2
  Top Layer w0.3: U5.11 76.51,32.83 77.69,34 v1(77.69,34.13) ; U6.4 44.03,64.31 44.03,62.07
  Bottom Layer w0.3: v1(77.69,34.13) 77.69,34.25 78.96,35.52 78.96,38.94 75.21,42.69 63.66,42.69 52.29,54.06 46.06,54.06 41.75,58.38 41.75,60.8 42.95,62 v1(44.03,62)
FSMC_A2: length 63.4
  Top Layer w0.3: U5.12 77.01,32.56 v1(78.58,34.13) ; U6.3 43.14,64.29 43.14,61.68 43.63,61.2 v1(44.03,61.2)
  Bottom Layer w0.3: v1(78.58,34.13) 78.58,34.25 79.46,35.14 79.46,39.07 75.4,43.14 63.94,43.14 52.38,54.7 46.19,54.7 42.38,58.51 42.38,60.41 43.17,61.2 v1(44.03,61.2)
FSMC_A3: length 63.4
  Top Layer w0.3: 44.03,60.4 43.28,60.4 42.4,61.28 U6.2 ; v1(79.46,33.87) 77.51,31.92 U5.13
  Bottom Layer w0.3: v1(79.46,33.87) 79.97,34.38 79.97,39.21 75.53,43.65 64.07,43.65 52.39,55.33 46.2,55.33 43.02,58.51 43.02,60.03 43.38,60.4 v1(44.03,60.4)
FSMC_A4: length 63.3
  Top Layer w0.3: v1(44.03,59.6) 43.07,59.6 41.6,61.07 U6.1 ; U5.14 78.01,31.66 79.34,32.98 v1(79.46,32.98)
  Bottom Layer w0.3: v1(44.03,59.6) 44.21,59.6 45.43,58.38 51.26,58.38 64.21,45.43 75.91,45.43 80.48,40.86 80.48,33.37 80.09,32.98 v1(79.46,32.98)
FSMC_A5: length 77.7
  Top Layer w0.3: v1(79.46,32.09) 78.51,31.14 U5.15 ; v1(57.6,56.1) 53.68,56.1 53.05,56.73 43.27,56.73 40.98,59.02 40.98,73.88 41.62,74.51 41.62,75.64 U6.44
  Bottom Layer w0.3: v1(79.46,32.09) 79.85,32.09 81.12,33.36 81.12,41.62 74.34,48.39 67.08,48.39 60.77,54.7 59.14,54.7 57.75,56.1 57.6,56.1 v1(57.6,56.1)
FSMC_A6: length 159.6
  Top Layer w0.3: v1(14.31,92.55) 15.46,93.69 36.28,93.69 37.68,92.29 37.68,89.15 40.98,85.85 40.98,84.54 42.4,83.13 U6.43 42.38,75.64 42.38,74.76 44.1,73.04 45.11,73.04 49.02,69.13 55.63,69.13 61.05,63.72 61.05,59.65 60.54,59.14 v1(60.54,57.62) ; v1(85.18,41.36) 85.18,40.35 87.47,38.06 U5.50
  Bottom Layer w0.3: v1(14.31,92.55) 11.52,92.55 10.25,91.28 4.66,91.28 1.99,88.61 1.99,63.09 CN4.21 ; v1(85.18,41.36) 84.54,42 84.54,46.95 80.73,50.76 67.9,50.76 61.43,57.24 60.92,57.24 v1(60.54,57.62)
FSMC_A7: length 70.9
  Top Layer w0.3: U5.53 86.73,39.56 86.07,40.22 v1(86.07,41.36) ; v1(61.3,58) 61.56,58.26 61.56,63.97 55.94,69.59 49.21,69.59 45.3,73.5 44.29,73.5 43.2,74.58 U6.42
  Bottom Layer w0.3: v1(61.3,58) 68.03,51.27 81.12,51.27 86.07,46.32 v1(86.07,41.36)
FSMC_A8: length 85
  Top Layer w0.3: U6.27 55.2,78.44 57.11,80.35 71.84,80.35 78.96,73.24 91.78,73.24 v1(93.05,71.97) ; v1(97.5,41.11) 96.45,40.06 U5.54
  Bottom Layer w0.3: v1(97.5,41.11) 98.13,41.75 98.13,45.81 97.4,46.54 97.4,67.63 v1(93.05,71.97)
FSMC_A9: length 82
  Top Layer w0.254: U5.55 95.93,40.56 v1(96.48,41.11) ; v1(93.05,70.83) 91.15,72.73 78.45,72.73 71.34,79.85 57.37,79.85 56,78.48 U6.26
  Bottom Layer w0.254: v1(93.05,70.83) 96.86,67.02 96.86,46.32 97.7,45.48 97.7,42.33 v1(96.48,41.11)
FSMC_A10: length 78.8
  Top Layer w0.3: U5.56 95.54,41.06 v1(95.72,41.24) ; U6.25 56.8,78.26 57.87,79.34 70.96,79.34 78.07,72.23 90.39,72.23 v1(93.05,69.56)
  Bottom Layer w0.3: v1(93.05,69.56) 96.36,66.26 96.36,46.06 97.24,45.17 97.24,42.76 v1(95.72,41.24)
FSMC_A11: length 75.4
  Top Layer w0.3: v1(95.72,42.13) 95.15,41.56 U5.57 ; U6.24 57.6,78.05 58.38,78.83 70.7,78.83 77.81,71.72 89.37,71.72 v1(92.93,68.16)
  Bottom Layer w0.3: v1(92.93,68.16) 95.85,65.24 95.85,45.93 96.74,45.04 96.74,43.14 v1(95.72,42.13)
FSMC_A12: length 37.1
  Top Layer w0.3: U5.87 82.01,55.45 81.88,55.59 v1(81.88,56.86) ; U6.22 58.4,62.68 59.4,61.68 v1(60.29,61.68)
  Bottom Layer w0.3: v1(60.29,61.68) 70.07,61.68 71.97,63.59 78.19,63.59 79.21,62.57 79.21,58.89 81.24,56.86 v1(81.88,56.86)
FSMC_A13: length 33.1
  Top Layer w0.3: U6.21 57.6,62.72 59.53,60.8 v1(60.29,60.8) ; v1(80.99,56.22) 80.99,55.84 81.51,55.31 U5.88
  Bottom Layer w0.3: v1(60.29,60.8) 76.51,60.8 80.99,56.32 v1(80.99,56.22)
FSMC_A14: length 33.2
  Top Layer w0.3: v1(80.23,56.22) 80.23,55.84 81.01,55.05 U5.89 ; v1(60.29,60.03) 59.4,60.03 56.8,62.63 U6.20
  Bottom Layer w0.3: v1(80.23,56.22) 76.42,60.03 v1(60.29,60.03)
FSMC_A15: length 43
  Top Layer w0.3: U5.90 80.51,54.79 79.59,55.72 79.59,56.73 81.75,58.89 v1(81.75,59.53) ; v1(56.1,62.83) 56,62.92 U6.19
  Bottom Layer w0.3: v1(81.75,59.53) 82.26,60.03 82.26,62.57 79.34,65.49 70.57,65.49 68.95,63.87 57.14,63.87 v1(56.1,62.83)
FSMC_A16: length 47.9
  Top Layer w0.3: U5.80 85.51,53.76 87,55.25 v1(87,58.3) ; v1(55.21,62.83) 55.2,62.83 U6.18
  Bottom Layer w0.3: v1(87,58.3) 86.41,58.89 81.24,58.89 80.73,59.4 80.73,63.46 79.15,65.04 71.01,65.04 69.3,63.34 57.62,63.34 56.48,62.19 55.59,62.19 55.21,62.57 v1(55.21,62.83)
FSMC_A17: length 59.9
  Top Layer w0.3: U6.23 58.4,77.58 59.14,78.32 70.45,78.32 77.69,71.08 89.24,71.08 91.78,68.54 91.78,64.73 86.32,59.27 86.32,55.33 85.01,54.03 U5.81
FSMC_A18: length 60.4
  Top Layer w0.3: v1(85.31,58.26) 85.31,59.27 91.28,65.24 91.28,68.16 88.99,70.45 77.56,70.45 73.62,74.38 54.7,74.38 54.4,74.68 U6.28 ; U5.82 84.51,54.54 v1(84.67,54.7)
  Bottom Layer w0.3: v1(84.67,54.7) 84.67,57.62 v1(85.31,58.26)
FSMC_D0: length 102.3
  Top Layer w0.3: v1(83.53,58.13) 83.01,57.61 U5.85 ; v1(46.57,62.19) 46.4,62.36 U6.7 46.4,67.57 42.13,71.84 v1(42.13,72.99) ; CN4.18 10.45,64.93 14.19,68.67 33.74,68.67 36.28,71.21 v1(36.28,71.97)
  Bottom Layer w0.3: v1(36.28,71.97) 36.28,72.23 37.05,72.99 v1(42.13,72.99) ; v1(83.53,58.13) 82.89,57.49 81.24,57.49 79.72,59.02 79.72,62.95 78.58,64.1 71.72,64.1 69.94,62.32 58.39,62.32 57.36,61.29 46.97,61.29 46.57,61.68 v1(46.57,62.19)
FSMC_D1: length 134.4
  Top Layer w0.3: U5.86 82.51,51.11 v1(82.51,58.13) ; v1(47.21,67.27) 47.2,67.27 U6.8 47.2,62.33 v1(47.33,62.19) ; v1(7.58,87.59) 9.75,87.59 12.48,84.86 12.48,78.51 18.13,72.86 33.36,72.86 v1(33.62,73.11)
  Bottom Layer w0.3: v1(82.51,58.13) 81.36,58.13 80.25,59.24 80.25,63.18 78.84,64.59 71.32,64.59 69.61,62.88 57.93,62.88 56.79,61.74 55.28,61.74 54.78,62.24 47.38,62.24 v1(47.33,62.19) ; v1(33.62,73.11) 33.62,72.48 35.52,70.57 45.56,70.57 47.21,68.92 v1(47.21,67.27) ; CN4.17 3.01,67.15 3.01,86.32 4.28,87.59 v1(7.58,87.59)
FSMC_D2: length 83.6
  Top Layer w0.3: v1(35.52,72.61) 35.52,71.21 33.62,69.3 12.79,69.3 10.96,67.47 CN4.16 ; v1(42.13,73.88) 42.38,73.88 43.02,73.24 43.02,71.78 46.13,68.67 47.21,68.67 48,67.88 U6.9 48,60.57 v1(47.08,59.65) ; U5.114 67.41,46.56 67.15,46.83 v1(66.13,46.83)
  Bottom Layer w0.3: v1(35.52,72.61) 35.65,72.61 36.54,73.5 41.75,73.5 v1(42.13,73.88) ; v1(47.08,59.65) 47.59,59.65 47.95,59.29 51.64,59.29 64.22,46.7 66,46.7 v1(66.13,46.83)
FSMC_D3: length 115.4
  Top Layer w0.3: v1(34.63,72.61) 34.25,72.23 18.12,72.23 12.03,78.32 12.03,84.67 9.87,86.83 v1(7.58,86.83) ; v1(48.86,67.27) 48.8,67.22 U6.10 48.8,60.48 47.33,59.02 v1(46.7,59.02) ; U5.115 66.13,46.06 v1(66.13,46.06)
  Bottom Layer w0.3: CN4.15 3.52,69.18 3.52,86.07 4.28,86.83 v1(7.58,86.83) ; v1(46.7,59.02) 46.88,58.83 51.45,58.83 64.22,46.06 v1(66.13,46.06) ; v1(34.63,72.61) 34.63,72.23 35.65,71.21 45.68,71.21 48.86,68.03 v1(48.86,67.27)
FSMC_D4: length 120.6
  Top Layer w0.3: v1(82.77,43.27) 83.98,42.06 U5.58 ; CN4.14 8.92,70.01 v1(11.52,72.61) ; v1(51.14,66.51) 51.2,66.45 U6.13 51.2,62.01 51.4,61.81 51.4,59.4 53.9,56.9 v1(57.6,56.9)
  Bottom Layer w0.3: v1(57.6,56.9) 58.09,56.9 59.72,55.26 60.84,55.26 67.27,48.84 77.19,48.84 v1(82.77,43.27) ; v1(11.52,72.61) 14.69,75.78 14.69,83.91 15.84,85.05 25.24,85.05 30.19,80.1 45.29,80.1 46.95,78.44 46.95,70.7 v1(51.14,66.51)
FSMC_D5: length 141.3
  Top Layer w0.3: U5.59 84.49,42.56 v1(82.77,44.29) ; v1(57.6,57.7) 57.39,57.49 54.06,57.49 52,59.56 U6.14 52,66.35 v1(52.03,66.38) ; v1(14.44,85.81) 14.44,87.05 10.47,91.02 2.88,91.02 0.85,88.99 0.85,74.39 CN4.13
  Bottom Layer w0.3: v1(14.44,85.81) 25.24,85.81 30.39,80.66 45.37,80.66 47.59,78.44 47.59,71.08 52.03,66.64 v1(52.03,66.38) ; v1(82.77,44.29) 82.64,44.29 77.63,49.29 67.45,49.29 61.03,55.72 60.03,55.72 58.05,57.7 v1(57.6,57.7)
FSMC_D6: length 121
  Top Layer w0.3: v1(52.79,66.76) 52.79,64.35 U6.15 52.8,59.4 54.2,58 56.99,58 57.48,58.5 v1(57.6,58.5) ; v1(82.89,45.3) 85.13,43.06 U5.60 ; v1(11.14,75.4) 8.29,72.55 CN4.12
  Bottom Layer w0.3: v1(11.14,75.4) 12.92,77.18 12.92,85.56 13.93,86.58 25.36,86.58 30.82,81.12 45.56,81.12 49.37,77.31 49.37,70.19 v1(52.79,66.76) ; v1(57.6,58.5) 57.61,58.51 58,58.51 60.29,56.22 61.16,56.22 67.64,49.75 78.58,49.75 82.89,45.43 v1(82.89,45.3)
FSMC_D7: length 136.5
  Top Layer w0.3: v1(83.15,46.19) 84.78,44.56 U5.63 ; v1(53.56,66.89) 53.56,64.39 U6.16 53.6,59.24 54.38,58.45 56.55,58.45 57.4,59.3 v1(57.6,59.3) ; v1(13.3,87.34) 10.12,90.51 3.14,90.51 1.36,88.74 1.36,76.42 CN4.11
  Bottom Layer w0.3: v1(83.15,46.19) 79.08,50.25 67.77,50.25 61.29,56.73 60.54,56.73 57.97,59.3 v1(57.6,59.3) ; v1(53.56,66.89) 49.87,70.57 49.87,77.56 45.81,81.62 31.08,81.62 25.36,87.34 v1(13.3,87.34)
FSMC_D8: length 136.3
  Top Layer w0.254: v1(11.01,78.32) 11,78.32 CN4.10
  Top Layer w0.3: U5.64 92.28,45.06 92.55,44.79 v1(95.97,44.79) ; v1(83.5,67.8) 79.44,67.8 73.5,73.75 54.45,73.75 53.6,74.59 U6.29 53.6,80.14 v1(53.68,80.23)
  Bottom Layer w0.3: v1(11.01,78.32) 12.28,79.59 12.28,87.34 13.04,88.1 26.76,88.1 32.73,82.13 46.44,82.13 49.62,78.96 52.41,78.96 v1(53.68,80.23) ; v1(83.5,67.8) 91.38,67.8 95.34,63.84 95.34,45.56 95.97,44.92 v1(95.97,44.79)
FSMC_D9: length 146.5
  Top Layer w0.3: v1(83.5,66.8) 79.68,66.8 73.37,73.11 54.32,73.11 52.8,74.63 U6.30 52.79,75.66 v1(52.79,80.23) ; v1(4.15,89.75) 1.99,87.59 1.99,78.33 CN4.9 ; U5.65 91.07,45.56 92.55,45.56 92.68,45.43 v1(94.7,45.43)
  Bottom Layer w0.3: v1(52.79,80.23) 52.79,82.51 48.86,86.45 40.98,86.45 35.48,91.95 11.61,91.95 10.43,90.77 5.17,90.77 v1(4.15,89.75) ; v1(94.7,45.43) 94.83,45.56 94.83,63.21 91.24,66.8 v1(83.5,66.8)
FSMC_D10: length 128.9
  Top Layer w0.254: U6.31 52,80.19 v1(52.03,80.23) ; v1(10.63,80.99) 7.77,78.13 CN4.8
  Top Layer w0.3: U6.31 52,74.38 53.72,72.66 73.06,72.66 79.92,65.8 v1(83.5,65.8) ; v1(94.07,46.06) 92.93,46.06 92.93,46.06 U5.66
  Bottom Layer w0.254: v1(52.03,80.23) 52.03,79.97 51.52,79.46 49.87,79.46 46.7,82.64 33.24,82.64 27.35,88.53 12.87,88.53 11.65,87.31 11.65,82 v1(10.63,80.99)
  Bottom Layer w0.3: v1(94.07,46.06) 94.32,46.32 94.32,62.32 90.84,65.8 v1(83.5,65.8)
FSMC_D11: length 138.5
  Top Layer w0.254: CN4.7 2.5,80.36 2.5,87.08 v1(5.17,89.75)
  Top Layer w0.3: v1(93.69,46.83) 93.42,46.56 U5.67 ; v1(83.5,64.8) 80.16,64.8 72.75,72.21 53.32,72.21 51.2,74.33 U6.32 51.2,80.17 v1(51.14,80.23)
  Bottom Layer w0.3: v1(51.14,80.23) 51.14,82.77 48.1,85.81 40.35,85.81 34.66,91.5 11.8,91.5 10.56,90.26 5.55,90.26 5.17,89.88 v1(5.17,89.75) ; v1(93.69,46.83) 93.69,61.56 90.45,64.8 v1(83.5,64.8)
FSMC_D12: length 123.8
  Top Layer w0.254: v1(83.5,63.8) 80.4,63.8 72.42,71.78 51.47,71.78 48.8,74.45 U6.35 48.8,83.08 v1(48.73,83.15) ; U5.68 92.78,47.06 v1(93.05,47.33) ; CN4.6 8.54,80.17 v1(10.5,82.13)
  Bottom Layer w0.254: v1(48.73,83.15) 33.62,83.15 27.83,88.94 12.7,88.94 11.14,87.38 11.14,82.77 v1(10.5,82.13) ; v1(93.05,47.33) 93.05,60.67 89.92,63.8 v1(83.5,63.8)
FSMC_D13: length 125.8
  Top Layer w0.254: U6.36 48,85.02 v1(47.97,85.05) ; CN4.5 3.01,82.39 3.01,86.7 5.93,89.62 v1(7.07,89.62)
  Top Layer w0.3: U6.36 48,74.35 51,71.35 72.21,71.35 80.23,63.34 81.97,63.34 v1(83.5,61.8) ; U5.77 87.01,53.34 90.01,56.33 90.01,58.3 v1(90,58.3)
  Bottom Layer w0.254: v1(7.07,89.62) 10.53,89.62 11.98,91.07 33.82,91.07 39.84,85.05 v1(47.97,85.05)
  Bottom Layer w0.3: v1(90,58.3) 90.01,58.31 90.01,60.41 88.62,61.8 v1(83.5,61.8)
FSMC_D14: length 113.8
  Top Layer w0.3: U5.78 86.51,53.48 89,55.97 v1(89,58.3) ; v1(47.21,83.78) 47.2,83.78 U6.37 47.2,74.26 50.57,70.9 71.9,70.9 79.97,62.83 81.47,62.83 v1(83.5,60.8) ; v1(10.38,83.66) 9.43,82.71 CN4.4
  Bottom Layer w0.3: v1(89,58.3) 89,60.02 88.22,60.8 v1(83.5,60.8) ; v1(10.38,83.66) 10.38,87.22 12.52,89.37 28.42,89.37 34,83.78 v1(47.21,83.78)
FSMC_D15: length 119
  Top Layer w0.3: U5.79 86.01,53.62 88,55.61 v1(88,58.3) ; v1(46.06,84.42) 46.4,84.08 U6.38 46.4,73.67 49.62,70.45 71.59,70.45 79.85,62.19 81.12,62.19 83.5,59.81 v1(83.5,59.8) ; v1(7.58,88.99) 5.93,88.99 3.52,86.58 3.52,83.78 4.59,82.71 CN4.3
  Bottom Layer w0.3: v1(83.5,59.8) 87.06,59.8 88,58.86 v1(88,58.3) ; v1(7.58,88.99) 10.5,88.99 12.15,90.64 28.03,90.64 34.25,84.42 v1(46.06,84.42)
FSMC_NBL0: length 98.3
  Top Layer w0.3: U5.141 75.35,33.06 v1(75.4,33.11) ; v1(45.56,78.83) 45.6,78.78 U6.39
  Bottom Layer w0.3: v1(75.4,33.11) 75.4,34.38 77.56,36.54 77.56,38.44 74.64,41.36 63.08,41.36 51.9,52.54 45.3,52.54 35.92,61.92 35.92,67.89 31.84,71.97 31.84,76.42 35.07,79.65 44.74,79.65 v1(45.56,78.83)
FSMC_NBL1: length 97.8
  Top Layer w0.3: U5.142 75.19,32.56 75.4,32.35 v1(75.4,31.97) ; v1(44.79,78.32) 44.8,78.31 U6.40
  Bottom Layer w0.3: v1(44.79,78.32) 43.92,79.19 35.26,79.19 32.35,76.28 32.35,72.23 36.41,68.16 36.41,62.45 45.81,53.05 52.03,53.05 63.26,41.82 74.84,41.82 78.02,38.65 78.02,36.36 76.04,34.38 76.04,32.6 v1(75.4,31.97)
FSMC_NE3: length 57.6
  Top Layer w0.3: v1(78.32,42) 77.38,41.06 U5.125 ; U6.6 45.6,59.22 R10.1 45.35,58.8 v1(44.03,58.8)
  Bottom Layer w0.3: v1(44.03,58.8) 44.96,57.87 51.13,57.87 64.08,44.92 75.53,44.92 78.32,42.13 v1(78.32,42)
FSMC_NE4: length 90.7
  Top Layer w0.3: CN4.22 7.84,59.78 14.44,59.78 17.62,56.6 19.39,56.6 28.54,47.46 v1(28.54,47.08) ; v1(75.65,39.46) 75.4,39.71 74.38,39.71 74.04,40.06 U5.127
  Bottom Layer w0.3: v1(75.65,39.46) 76.67,38.44 76.67,36.29 74.5,34.13 66.11,34.13 63.08,37.16 61.57,37.16 51.65,47.08 v1(28.54,47.08)
FSMC_NOE: length 138.1
  Top Layer w0.254: v1(59.27,67.65) 56.91,70.02 49.42,70.02 45.43,74 44.54,74 44,74.54 U6.41
  Top Layer w0.3: v1(12.54,90.01) 12.54,91.78 14.89,94.14 36.59,94.14 38.32,92.42 38.32,89.24 44,83.56 U6.41 ; v1(66.13,47.84) 65.24,46.95 65.24,45.94 66.62,44.56 U5.118
  CPU1 w0.254: v1(59.27,67.65) 59.27,62.57 v1(55.84,59.14)
  Bottom Layer w0.3: v1(55.84,59.14) 55.84,56.86 61.18,51.52 63.3,51.52 66.13,48.7 v1(66.13,47.84) ; v1(12.54,90.01) 12.52,90.01 10.74,88.23 4.28,88.23 2.5,86.45 2.5,65.12 CN4.19
FSMC_NWE: length 84.9
  Top Layer w0.3: CN4.20 7.97,62.19 10.5,62.19 16.35,68.03 33.84,68.03 37.43,71.63 v1(37.43,72.23) ; v1(64.61,47.33) 64.61,45.68 66.23,44.06 U5.119 ; v1(54.83,59.14) 54.4,59.57 U6.17 54.4,67.19 53.05,68.54 48.6,68.54 44.67,72.48 43.78,72.48 v1(43.65,72.35)
  Bottom Layer w0.3: v1(54.83,59.14) 54.83,56.86 64.35,47.33 v1(64.61,47.33) ; v1(43.65,72.35) 43.52,72.23 v1(37.43,72.23)
GT_CE: length 55.1
  Top Layer w0.3: U10.2 77.08,82.03 80.35,85.31 87.47,85.31 96.86,75.91 96.86,60.16 89.01,52.31 U5.73
GT_CS: length 52.5
  Top Layer w0.3: U5.74 88.51,52.57 96.23,60.29 96.23,75.53 87.08,84.67 80.86,84.67 78.35,82.16 U10.3
GT_IRQ: length 41.5
  Top Layer w0.3: U10.7 83.43,78.12 85.38,76.16 93.18,76.16 95.47,73.88 95.47,60.29 88.01,52.84 U5.75
GT_MISO: length 72.8
  Top Layer w0.3: v1(86.7,32.22) 86.19,32.22 85.01,31.04 U5.28 ; v1(93,75) 93,75.07 92.67,75.4 84.8,75.4 82.16,78.04 U10.6
  Bottom Layer w0.3: v1(86.7,32.22) 94.83,32.22 98.64,36.03 98.64,69.56 93.2,75 v1(93,75)
GT_MOSI: length 78.6
  Top Layer w0.3: U5.29 85.51,30.78 86.2,31.46 v1(86.7,31.46) ; U10.5 80.89,82.28 82.13,83.53 86.7,83.53 v1(92.93,77.31)
  Bottom Layer w0.3: v1(86.7,31.46) 95.09,31.46 99.15,35.52 99.15,71.08 v1(92.93,77.31)
GT_SCK: length 53.8
  Top Layer w0.3: U5.69 92.39,47.56 92.8,47.97 97.12,47.97 v1(98.01,47.08) ; U10.4 79.62,78.05 83.53,74.13 92.87,74.13 v1(93,74)
  Bottom Layer w0.3: v1(98.01,47.08) 98.13,47.21 98.13,69.18 93.31,74 v1(93,74)
JDY_GPIO1: length 81.6
  Top Layer w0.3: U5.126 74.43,40.56 v1(74.51,40.48) ; v1(20.03,76.29) 20.03,79.37 U9.9
  Bottom Layer w0.3: v1(20.03,76.29) 20.92,77.18 25.49,77.18 35.47,67.2 35.47,61.49 45.05,51.91 51.9,51.91 63.33,40.48 v1(74.51,40.48)
JDY_GPIO2: length 78.7
  Top Layer w0.3: U5.117 71.45,45.06 v1(72.23,44.29) ; v1(51.91,55.97) 43.27,55.97 40.35,58.89 40.35,74.13 39.08,75.4 23.08,75.4 21.5,76.98 U9.10
  Bottom Layer w0.3: v1(51.91,55.97) 52.39,55.97 64.08,44.29 v1(72.23,44.29)
JDY_GPIO3: length 75.5
  Top Layer w0.3: v1(25.36,76.16) 26,76.8 26,79.4 U9.13 ; v1(74,39.21) 73.65,39.56 U5.128
  Bottom Layer w0.3: v1(74,39.21) 73.24,39.97 63.19,39.97 51.76,51.4 44.41,51.4 35.01,60.8 35.01,66.51 v1(25.36,76.16)
JDY_GPIO4: length 95.4
  Top Layer w0.3: v1(75.15,38.57) 72.35,38.57 71.86,39.06 U5.129 ; v1(20.54,83.15) 20.54,86.96 19.49,88 U9.4
  Bottom Layer w0.3: v1(20.54,83.15) 19.24,81.85 19.24,75.81 23.58,71.46 28.44,71.46 34.25,65.65 34.25,60.67 44.03,50.89 51.63,50.89 63.01,39.51 71.53,39.51 72.48,38.57 v1(75.15,38.57)
JDY_PWRC: length 82.4
  Top Layer w0.3: v1(79.59,52.79) 79.51,52.72 U5.92 ; v1(37.94,77.56) 37.94,87.21 35.65,89.5 U9.22
  Bottom Layer w0.3: v1(79.59,52.79) 77.81,52.79 71.84,58.76 59.53,58.76 58,60.29 46.06,60.29 45.3,61.05 45.3,64.35 44.03,65.62 39.71,65.62 32.86,72.48 32.86,75.27 34.38,76.8 37.17,76.8 v1(37.94,77.56)
JDY_STAT: length 91.5
  Top Layer w0.3: v1(79.08,53.56) 79.01,53.49 U5.93 ; v1(39.71,68.03) 39.71,73.88 38.7,74.89 20.03,74.89 14.06,80.86 14.06,83.78 15.28,85 U9.6
  Bottom Layer w0.3: v1(79.08,53.56) 77.81,53.56 71.97,59.4 60.03,59.4 58.6,60.84 46.78,60.84 45.94,61.68 45.94,65.11 44.92,66.13 40.86,66.13 39.71,67.27 v1(39.71,68.03)
KEY_ON: length 65.7
  Top Layer w0.3: 26.92,62.03 26.92,61.4 27.78,60.54 32.09,60.54 35.9,56.73 v1(35.9,45.68) ; v1(65.88,32.09) 66.76,32.09 68.23,33.56 U5.140
  Top Layer w0.5: Q2.3 R3.2
  Bottom Layer w0.3: v1(35.9,45.68) 35.9,45.3 36.41,44.79 51.78,44.79 60.92,35.65 61.94,35.65 65.49,32.09 v1(65.88,32.09)
L_IN: length 96
  Top Layer w0.3: v1(71.34,37.55) 70.84,37.06 U5.133
  CPU1 w0.3: CN3.3 70.7,12.7 70.7,36.92 v1(71.34,37.55) 71.34,48.48 66,53.81 v1(66,77.31)
  Bottom Layer w0.3: v1(66,77.31) 66,77.94 60,83.94 CN1.3
L_RCK: length 109.2
  Top Layer w0.3: v1(72.1,37.17) 71.49,36.56 U5.134
  CPU1 w0.3: CN3.2 63.5,6.66 64.86,5.3 71.46,5.3 72.73,6.57 72.73,9.49 71.15,11.07 71.15,36.23 v1(72.1,37.17) 72.1,42.89 73.11,43.9 73.11,47.46 66.64,53.94 66.64,75.78 67.02,76.16 v1(67.02,77.31)
  Bottom Layer w0.3: CN1.2 62.5,82.59 67.02,78.07 v1(67.02,77.31)
L_SCK: length 113.9
  Top Layer w0.3: v1(72.73,35.78) 72.45,36.06 U5.135
  CPU1 w0.254: v1(72.73,35.78) 71.72,34.76 71.72,11.27 73.37,9.61 73.37,5.93 71.97,4.53 62.57,4.53 60.92,6.19 60.92,7.92 CN3.1
  CPU1 w0.3: v1(72.73,35.78) 72.73,42.63 73.62,43.52 73.62,47.71 67.27,54.06 67.27,75.27 68.03,76.04 v1(68.03,77.18)
  Bottom Layer w0.3: CN1.1 64.73,94.73 64.73,82.77 68.03,79.46 v1(68.03,77.18)
LCD_BL: length 93.4
  Top Layer w0.3: U5.76 87.51,53.1 91,56.58 v1(91,58.3) ; R24.1 21.55,50.75 v1(21.55,50) ; v1(39.84,50.25) 39.86,50.25 42.21,52.61 44.66,54.95 61.05,54.95 68.42,62.32 v1(68.42,64.48)
  Bottom Layer w0.3: v1(39.84,50.25) 21.81,50.25 v1(21.55,50) ; v1(68.42,64.48) 69.94,66 79.59,66 82.89,62.7 89.24,62.7 91,60.94 v1(91,58.3)
LED_1: length 60.7
  Top Layer w0.3: v1(61.94,65.49) 68.8,65.49 v1(75.02,59.27) ; v1(82.51,32.98) 82.13,32.98 80.51,31.37 U5.19
  Bottom Layer w0.3: v1(75.02,59.27) 75.02,57.24 77.81,54.45 79.59,54.45 88.48,45.56 88.48,38.95 v1(82.51,32.98) ; LED2.2 58,66.26 58.76,65.49 v1(61.94,65.49)
LED_2: length 59.1
  Top Layer w0.3: v1(61.94,66.26) 69.05,66.26 75.78,59.53 v1(75.78,58.64) ; v1(82.64,32.09) 81.88,32.09 81.01,31.23 U5.20
  Bottom Layer w0.3: LED3.2 60.5,66.55 60.8,66.26 v1(61.94,66.26) ; v1(75.78,58.64) 77.05,57.37 77.05,55.97 78.07,54.95 79.84,54.95 79.84,54.96 88.99,45.81 88.99,38.44 v1(82.64,32.09)
LED_PWR: length 76.4
  Top Layer w0.3: v1(62.57,58) v1(62.57,64.73) ; v1(82.26,33.87) 82.26,33.75 80.01,31.51 U5.18
  Bottom Layer w0.3: LED1.2 44.92,67.15 47.71,64.35 62.32,64.35 62.57,64.61 v1(62.57,64.73) ; v1(62.57,58) 62.7,58 68.54,52.16 81.12,52.16 87.97,45.3 87.97,39.59 v1(82.26,33.87)
MCU_RX1: length 88.6
  Top Layer w0.3: U5.102 74.51,48.98 82,41.49 82,40.6 v1(82.89,39.71)
  CPU1 w0.3: v1(82.89,39.71) 83.27,39.71 85.62,37.37 85.62,30.88 82,27.27 82,10 74.51,2.5 51.75,2.5 U12.6
MCU_RX2: length 96.6
  Top Layer w0.3: U9.19 33.72,85.18 v1(37.05,85.18) ; U5.37 89.27,31.56 87.85,32.98 v1(87.85,35.01)
  CPU1 w0.3: v1(87.85,35.01) 87.85,37.3 70.96,54.19 70.96,77.81 67.15,81.62 39.84,81.62 37.05,84.42 v1(37.05,85.18)
MCU_TX1: length 92.8
  Top Layer w0.3: v1(82.89,40.6) 82.64,40.86 82.64,41.75 75.01,49.37 U5.101
  CPU1 w0.3: v1(82.89,40.6) 83.14,40.6 86.07,37.67 86.07,30.7 82.64,27.27 82.64,8.73 75.78,1.87 49.88,1.87 U12.5
MCU_TX2: length 97.7
  Top Layer w0.3: U9.20 33.72,86.32 v1(36.16,86.32) ; v1(87.08,34.76) 87.08,32.98 89.01,31.05 U5.36
  CPU1 w0.3: v1(36.16,86.32) 36.16,83.91 38.95,81.12 66.76,81.12 69.81,78.07 69.81,54.57 87.08,37.3 v1(87.08,34.76)
NRST: length 155.9
  Top Layer w0.3: v1(83.91,27.39) 83.51,27.79 U5.25 83.51,33.89 82.64,34.76 73.75,34.76 73.37,35.14 v1(73.37,37.43) ; 93.11,24.15 SW2.2 94.19,24.22 94.83,24.85 94.83,25.62 R20.2 ; 93.11,24.15 v1(91.91,22.95) ; 93.11,24.15 93.11,17.62 ; SW2.1 93.11,16.3 C42.2 ; CN4.1 5.23,87.27 6.31,88.35 11.27,88.35 13.17,86.45 13.17,79.08 18.38,73.88 37.81,73.88 39.08,72.61 39.08,59.27 39.97,58.38 39.97,51.65 38.44,50.13 v1(38.44,49.62)
  Bottom Layer w0.3: v1(73.37,37.43) 72.35,36.41 65.75,36.41 63.59,38.57 62.32,38.57 51.4,49.49 38.57,49.49 v1(38.44,49.62) ; v1(83.91,27.39) 83.91,26.76 88.23,22.44 91.4,22.44 v1(91.91,22.95)
OSC32_IN: length 15.6
  Top Layer w0.3: U5.8 75.01,28.03 76.54,26.5 76.54,21.68 75.65,20.79 73.62,20.79 73.26,20.43 Y1.2 73.26,17.59 C5.1
OSC32_OUT: length 13.4
  Top Layer w0.3: U5.9 75.51,28.17 77.05,26.63 77.05,20.56 Y1.1 75.54,19.04 C6.1
OSC_IN: length 14.7
  Top Layer w0.3: C7.1 82.03,18.37 Y2.2 82.51,19.04 U5.23
OSC_OUT: length 15.9
  Top Layer w0.3: C8.1 86.04,15.49 Y2.1 83.01,21.49 U5.24
OV_PWDN: length 34.6
  Top Layer w0.3: 47.75,30.56 47.75,35.05 47.97,35.27 v1(47.97,35.78) ; 53.94,38.06 v1(53.81,38.06) ; 53.94,38.06 55.72,38.06 57.75,40.09 63.72,40.09 65.18,41.56 U5.124 ; 53.94,38.06 53.87,38.13
  Bottom Layer w0.3: v1(47.97,35.78) 47.97,40.09 49.11,41.24 50.89,41.24 53.81,38.32 v1(53.81,38.06)
OV_RESET: length 30.5
  Top Layer w0.3: 46.75,30.56 46.75,36.33 47.59,37.17 54.07,37.17 55.85,35.4 61.05,35.4 61.68,36.03 64.48,36.03 66.01,37.56 U5.132
OV_SCL: length 42.9
  Top Layer w0.254: U5.122 64.91,42.56 63.46,41.11 56.99,41.11 v1(55.72,39.84)
  Top Layer w0.3: R8.2 46.25,26.69 46.25,36.35 v1(45.3,37.3)
  Bottom Layer w0.254: v1(45.3,37.3) 45.3,40.73 48.1,43.52 51.02,43.52 54.7,39.84 v1(55.72,39.84)
OV_SDA: length 42
  Top Layer w0.3: R9.2 45.25,27 45.25,36.36 v1(45.3,36.41) ; U5.123 65.02,42.06 63.56,40.6 57.34,40.6 55.81,39.08 v1(55.72,39.08)
  Bottom Layer w0.3: v1(55.72,39.08) 54.7,39.08 50.89,42.89 48.6,42.89 46.19,40.48 46.19,37.05 45.56,36.41 v1(45.3,36.41)
OV_XCLK: length 62.9
  Top Layer w0.3: v1(52.29,38.7) 61.38,47.79 61.38,51.96 67.42,58 72.35,58 74.38,55.97 74.38,54.32 75.51,53.19 U5.100 ; 53.02,22.96 53.05,22.98 53.05,24.73 50.25,27.53 50.25,32.61 49.24,33.62 v1(48.48,33.62)
  Bottom Layer w0.3: v1(52.29,38.7) 50.25,40.73 49.49,40.73 48.73,39.97 48.73,33.87 v1(48.48,33.62)
PWR_EN: length 47
  Top Layer w0.3: v1(65.88,32.86) 66.76,32.86 67.97,34.06 U5.139 ; v1(36.92,45.68) 36.92,52.63 38.1,53.81
  Bottom Layer w0.3: v1(36.92,45.68) 37.17,45.43 51.91,45.43 61.18,36.16 62.57,36.16 63.59,35.14 63.59,35.14 v1(65.88,32.86)
SW_EN: length 46.6
  Top Layer w0.5: v2(13.42,31.59) 14.56,32.72 R7.2 16.09,35.02 16.09,36.94 U3.1 ; D2.1 31.59,53.81 30.57,52.79 D1.1 29.55,50.72 29.55,36.54 v2(30.06,36.03)
  Bottom Layer w0.5: v2(13.42,31.59) 25.62,31.59 v2(30.06,36.03)
SWCLK: length 103.2
  Top Layer w0.3: v1(39.59,11.65) 38.75,10.81 U12.3 ; U5.109 72.78,49.06 80.73,41.11 80.73,39.71 v1(82,38.44)
  CPU1 w0.3: v1(82,38.44) 82.51,37.94 83.4,37.94 84.67,36.67 84.67,31.46 82.26,29.05 79.72,29.05 78.45,27.78 78.45,26.76 80.41,24.8 80.41,10.3 73.88,3.77 53.68,3.77 45.81,11.65 v1(39.59,11.65)
SWDIO: length 103.2
  Top Layer w0.3: U5.105 73.01,49.59 81.37,41.24 81.37,40.22 82.77,38.82 v1(82.89,38.82)
  CPU1 w0.3: v1(82.89,38.82) 83.4,38.82 85.16,37.06 85.16,31.22 82.48,28.54 80.1,28.54 79.08,27.52 79.08,26.89 80.86,25.11 80.86,9.87 74.26,3.26 53.3,3.26 45.68,10.88 38.82,10.88 36.25,8.31 U12.2
T_CS: length 80.4
  Top Layer w0.254: v1(74.51,31.97) 74.51,31.96 U5.7
  Top Layer w0.3: v1(27.65,46.44) 27.65,47.59 19.27,55.97 17.23,55.97 15.89,57.31 CN4.24
  Bottom Layer w0.3: v1(27.65,46.44) 51.64,46.44 61.42,36.67 62.94,36.67 65.98,33.62 72.86,33.62 v1(74.51,31.97)
T_MISO: length 97.4
  Top Layer w0.3: v1(25.74,47.84) 25.74,48.73 19.27,55.21 v1(18.25,55.21) ; R13.1 94.19,37.06 U5.48 75.41,37.06 74.89,36.54 v1(74.89,35.52)
  Bottom Layer w0.3: v1(74.89,35.52) 74.89,35.4 74.13,34.63 66.25,34.63 63.27,37.61 61.76,37.61 51.52,47.84 v1(25.74,47.84) ; v1(18.25,55.21) 17.81,54.77 CN4.26
T_MOSI: length 105.9
  Top Layer w0.3: CN4.25 3.14,52.68 3.14,46.32 3.77,45.68 17.62,45.68 v1(17.74,45.81) ; v1(74.13,35.52) 74.13,36.42 75.27,37.56 U5.49
  Bottom Layer w0.3: v1(74.13,35.52) 73.75,35.14 66.38,35.14 63.46,38.06 62.07,38.06 51.4,48.73 20.66,48.73 v1(17.74,45.81)
T_PEN: length 108.3
  Top Layer w0.3: v1(1.61,45.43) 2.63,44.41 17.62,44.41 v1(18,44.79) ; v1(48.98,42.13) 48.86,42.25 v1(30.95,42.25) ; U5.47 82.41,36.56 v1(82,36.16)
  Bottom Layer w0.3: v1(82,36.16) 81.62,35.78 81.62,33.11 79.85,31.33 63.08,31.33 61.18,33.24 58,33.24 54.57,36.67 54.57,38.44 50.89,42.13 v1(48.98,42.13) ; v1(1.61,45.43) 1.61,49.75 R23.2 ; v1(30.95,42.25) 30.06,42.25 24.47,47.84 21.04,47.84 v1(18,44.79)
T_SCK: length 167.9
  Top Layer w0.3: v1(75.78,36.41) 80.1,36.41 80.99,35.52 83.45,35.52 83.99,36.06 U5.46 ; v1(21.3,84.04) v1(21.3,92.8)
  Bottom Layer w0.3: CN4.23 1.23,61.31 1.23,88.61 4.41,91.78 10,91.78 11.77,93.56 20.54,93.56 v1(21.3,92.8) ; v1(75.78,36.41) 74.23,37.96 72.2,37.96 71.1,39.06 62.59,39.06 51.21,50.44 43.59,50.44 33.62,60.41 33.62,65.37 28.16,70.83 23.2,70.83 17.87,76.16 17.87,82.89 18.89,83.91 21.17,83.91 v1(21.3,84.04)
USB+: length 25.6
  Top Layer w0.6: 17.49,5 17.36,4.87 17.36,4.03 18.12,3.26 20.28,3.26 21.04,4.03 21.04,5.02 ; 17.49,5 U13.2 ; 17.49,5 17.36,5.13 17.36,11.52 16.73,12.15 15.57,12.15 C38.2 ; R15.2 17.87,14.69 16.1,12.91 ; U11.4 13.98,13.75 C38.2 ; 16.1,12.91 C38.2 ; 16.1,12.91 R14.2
$1N8883: length 13.5
  Top Layer w0.5: C32.2 29.17,20.32 29.17,21.25 U8.2 28.53,21.93 ; 28.53,21.93 30.56,23.96 L3.1 ; 28.53,21.93 30.19,21.93 30.86,21.26 C31.2 32.3,19.98 L4.1
$1N11070: length 8.4
  Top Layer w0.5: L1.1 54.17,17.6 53.02,18.76 53.02,17.59 52.67,17.23 51.02,17.23 50.33,17.92 C1.2
